# EAGLE design Main (EAGLE 7.7.0)
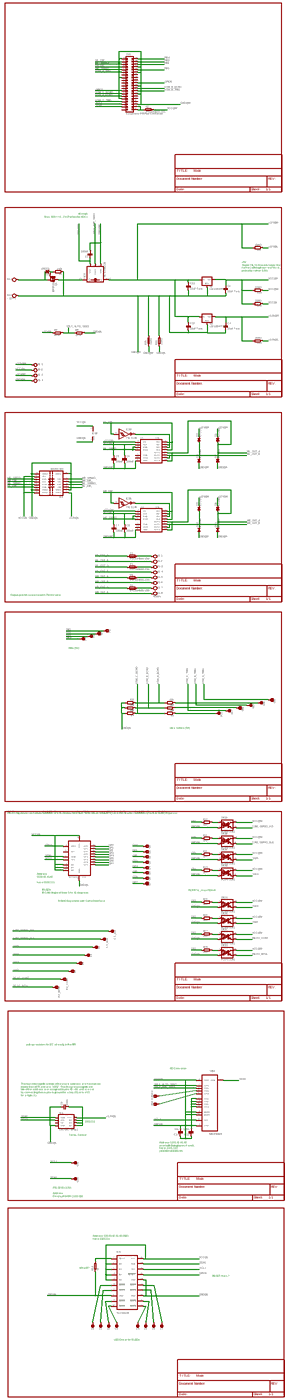
[diagram p0: schematic, sheet 1, overview]
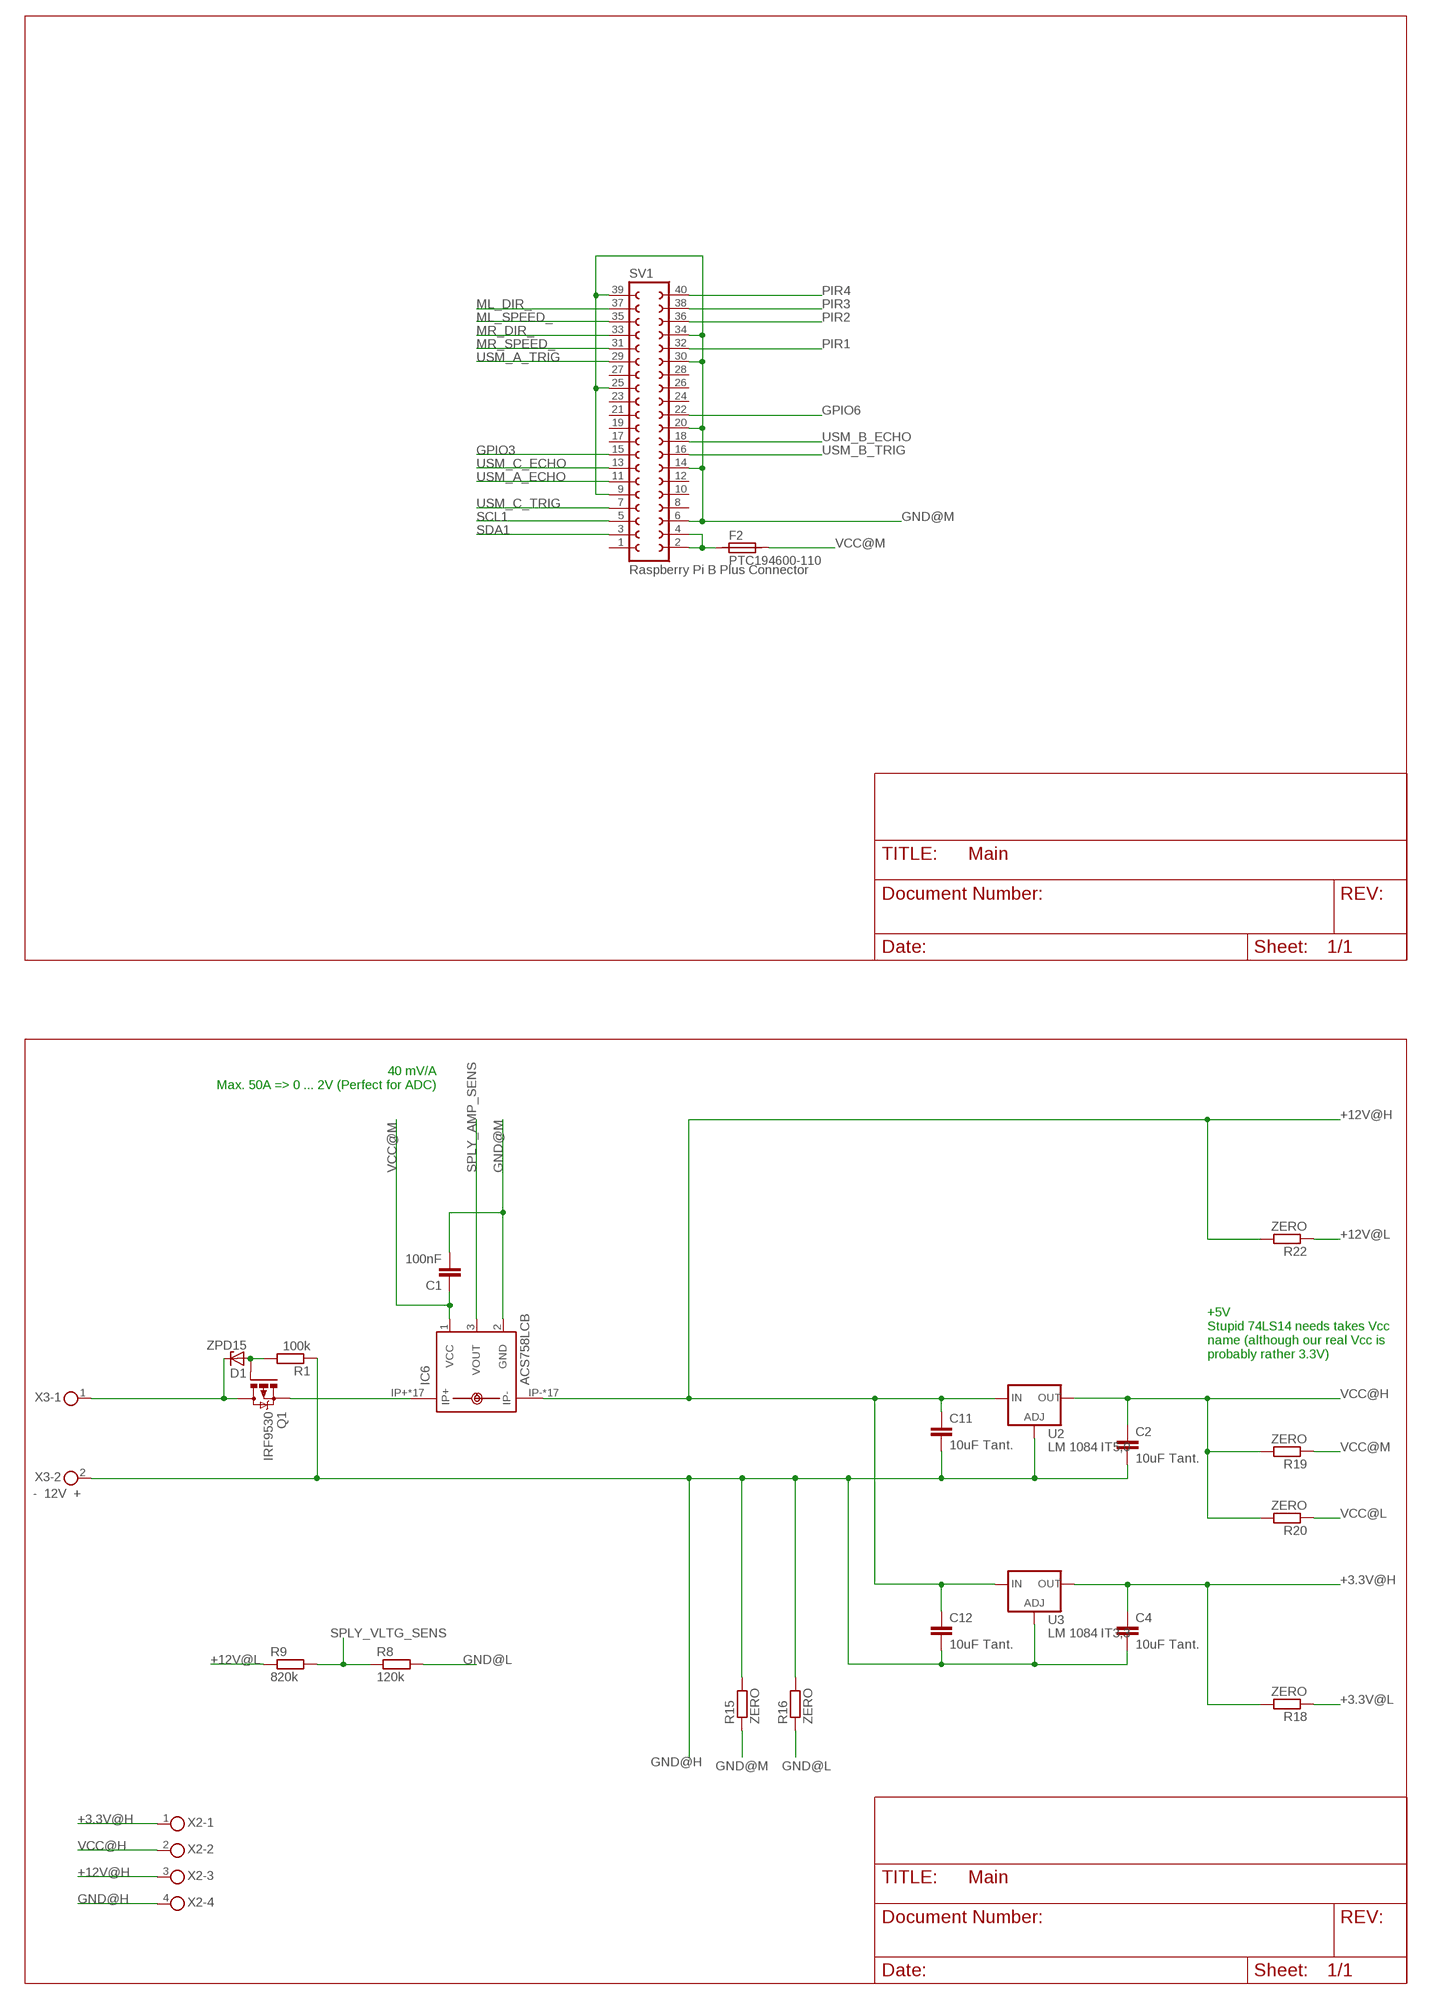
[diagram p1: schematic, sheet 1, part 1 of 4]
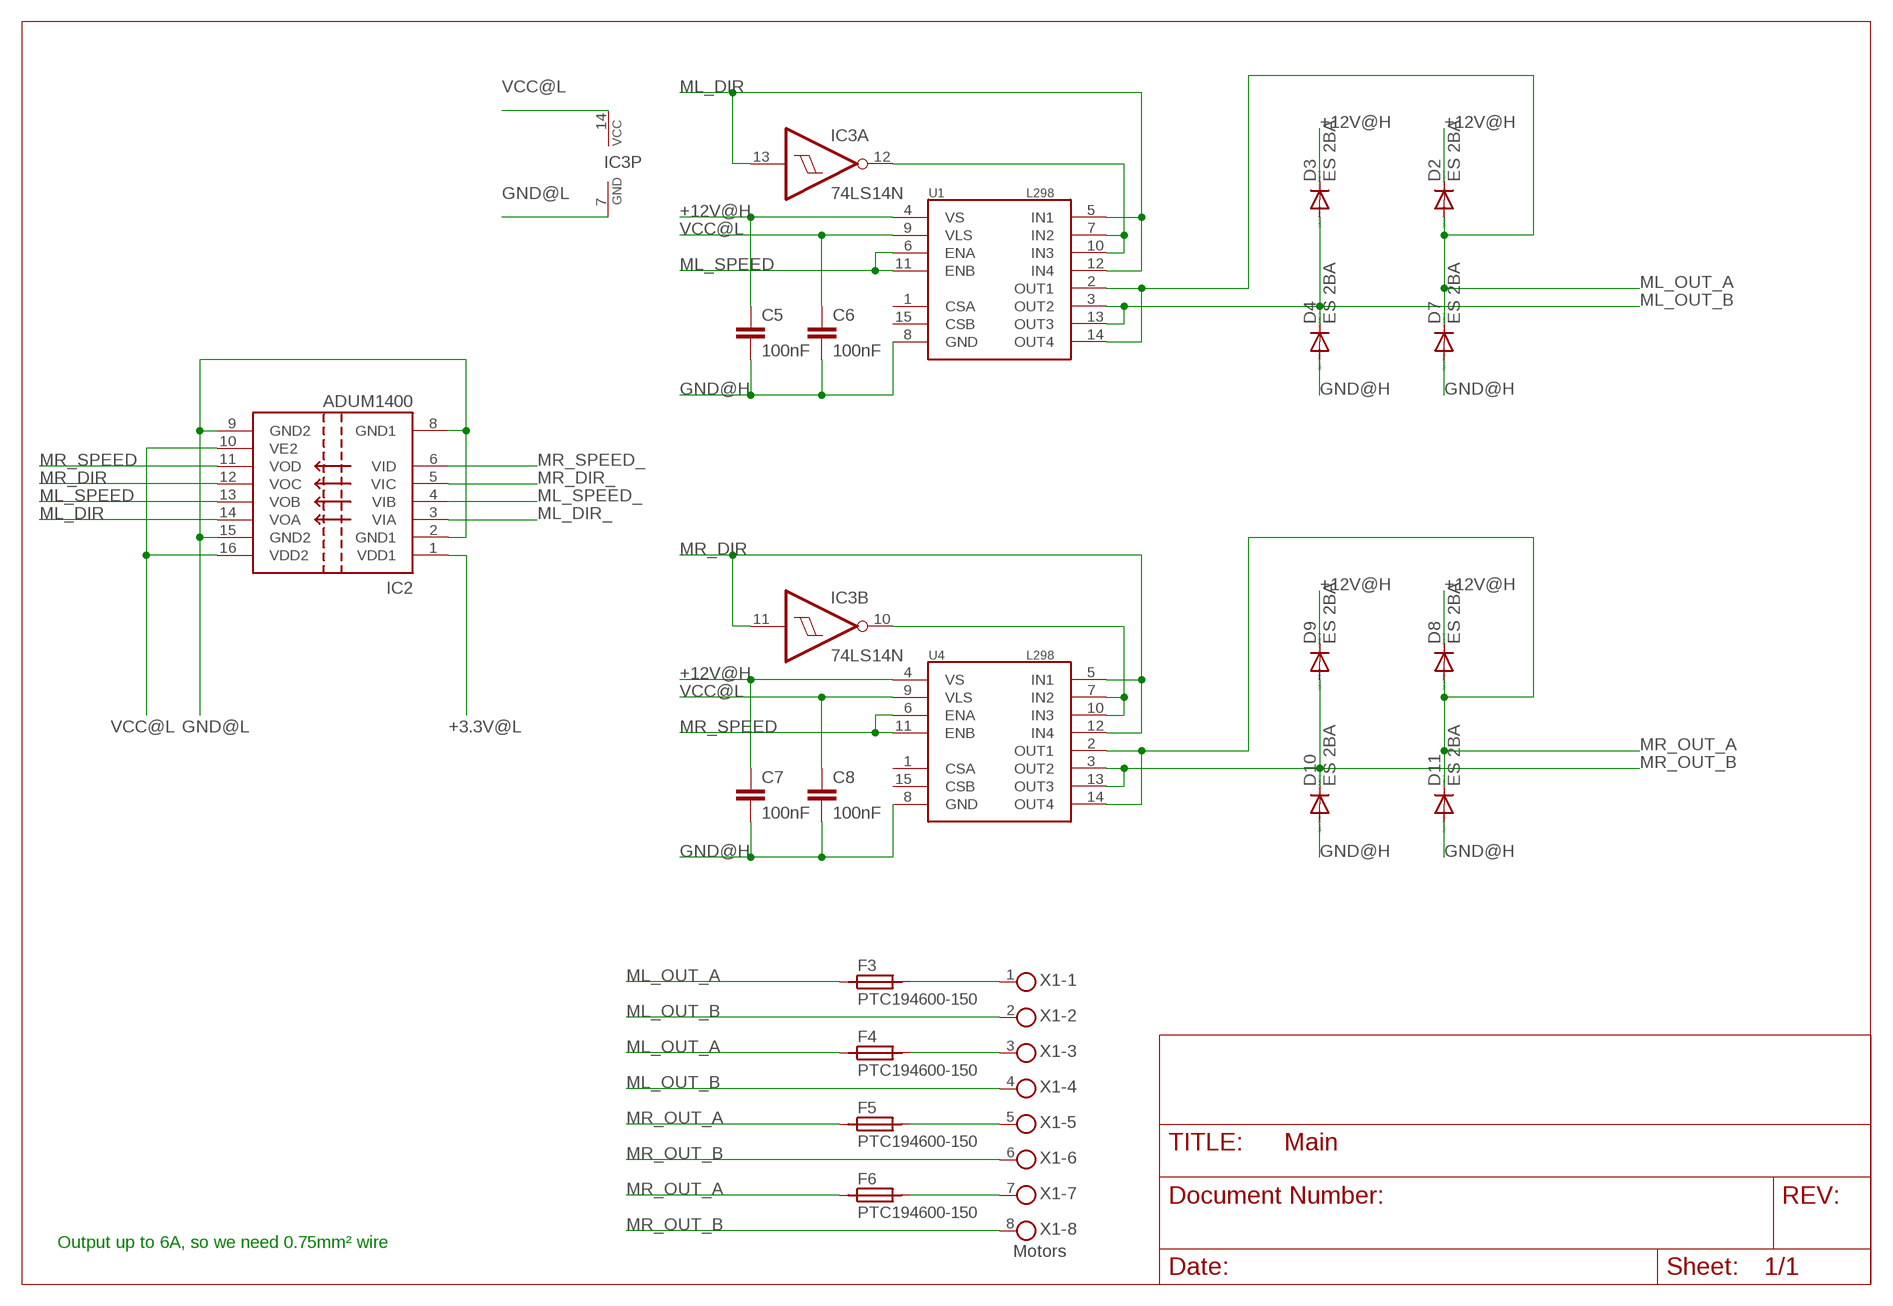
[diagram p2: schematic, sheet 1, part 2 of 4]
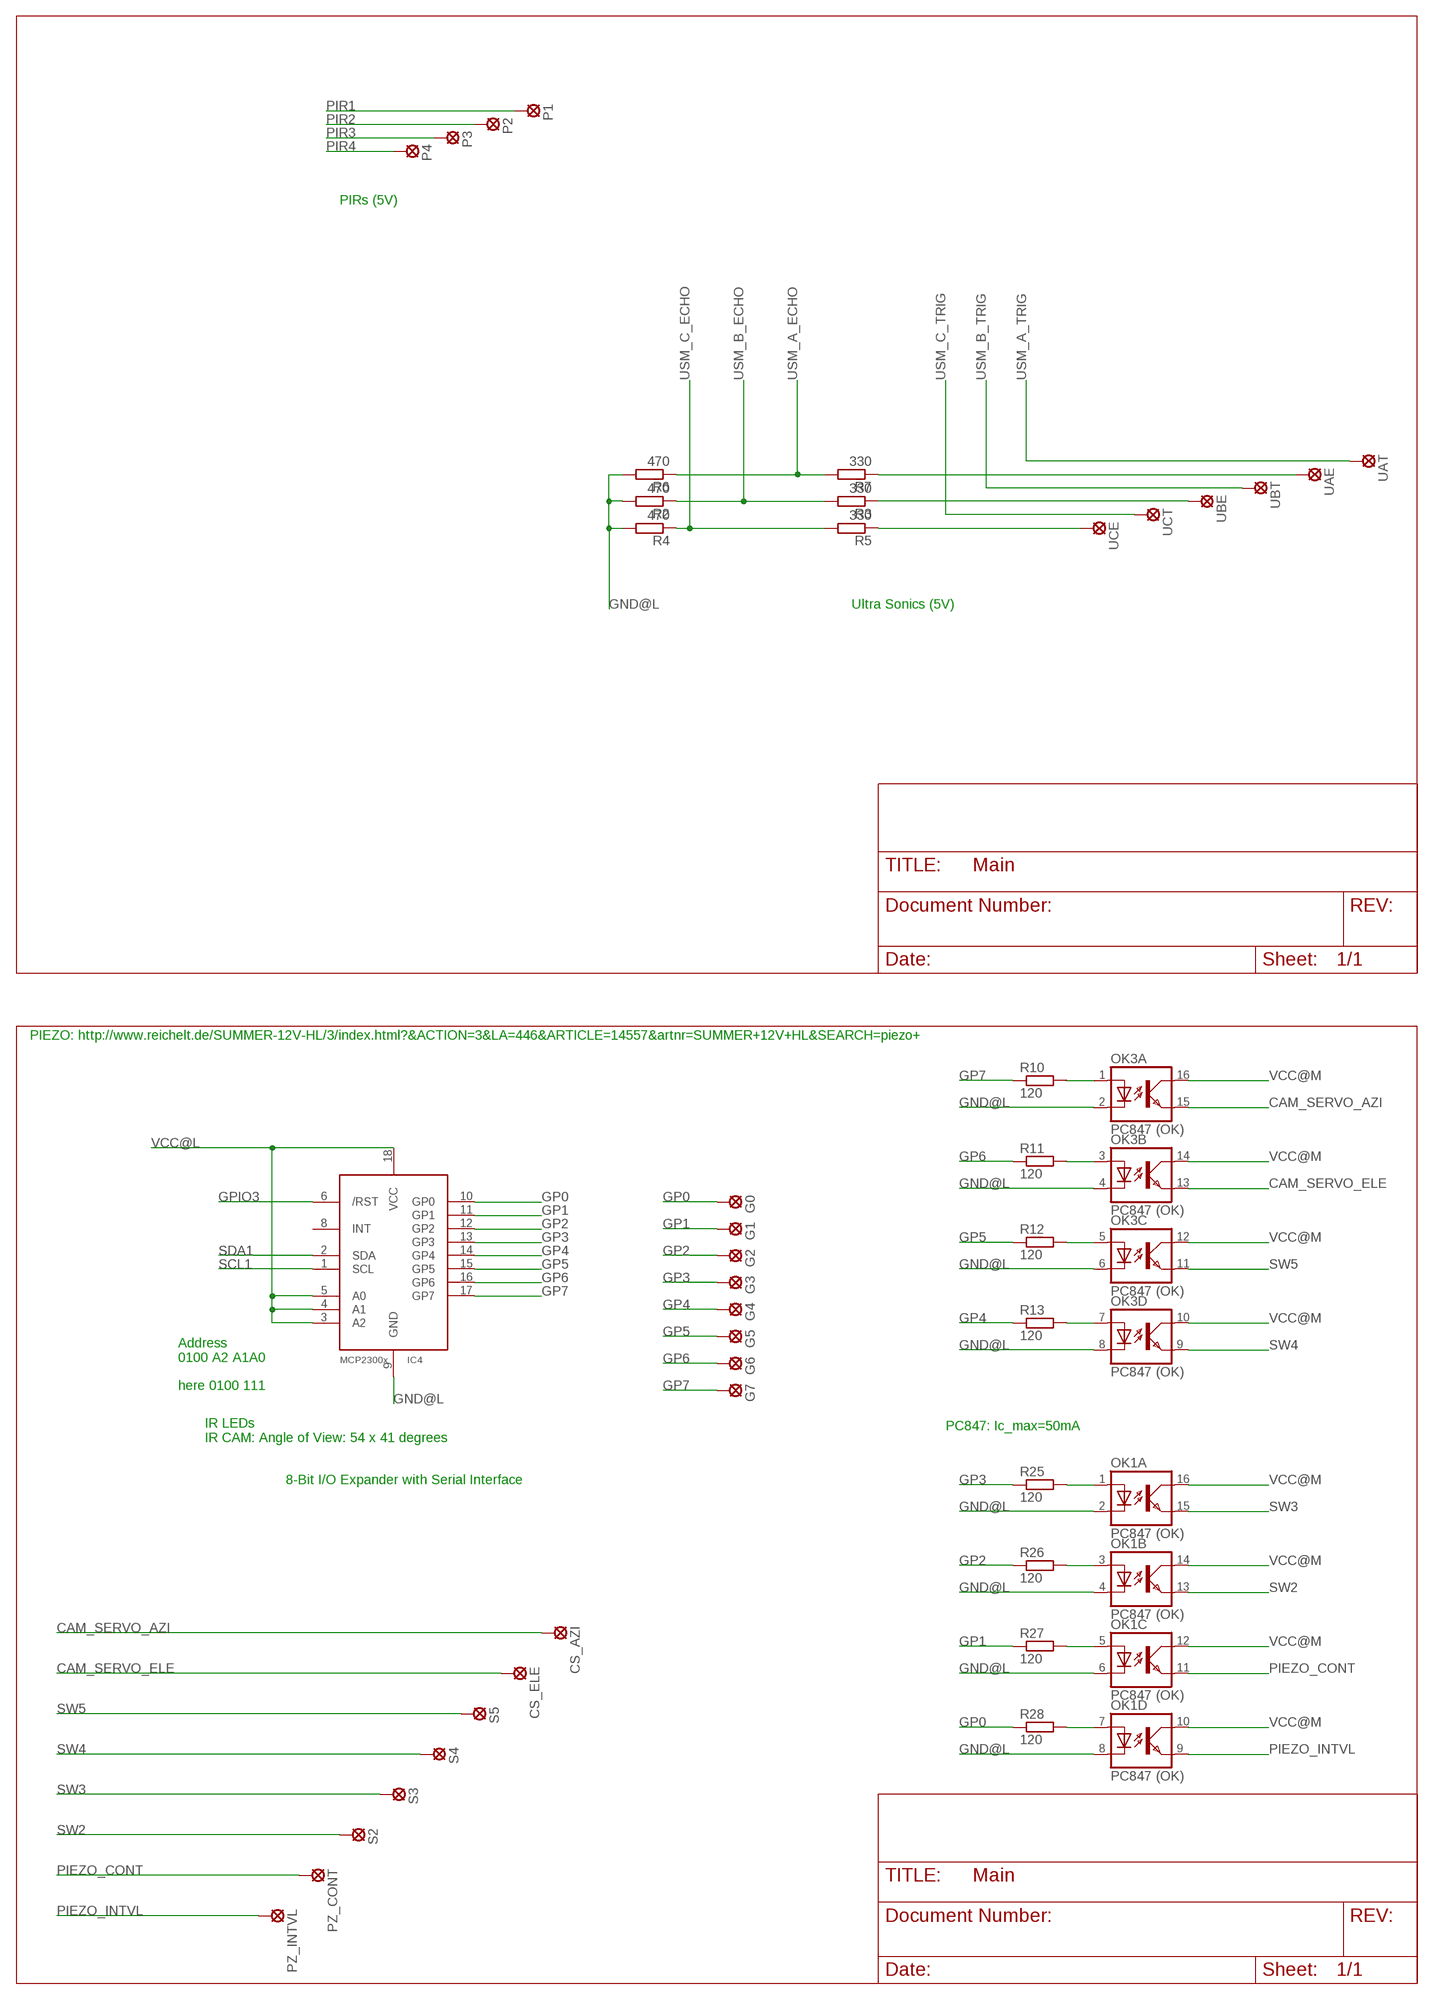
[diagram p3: schematic, sheet 1, part 3 of 4]
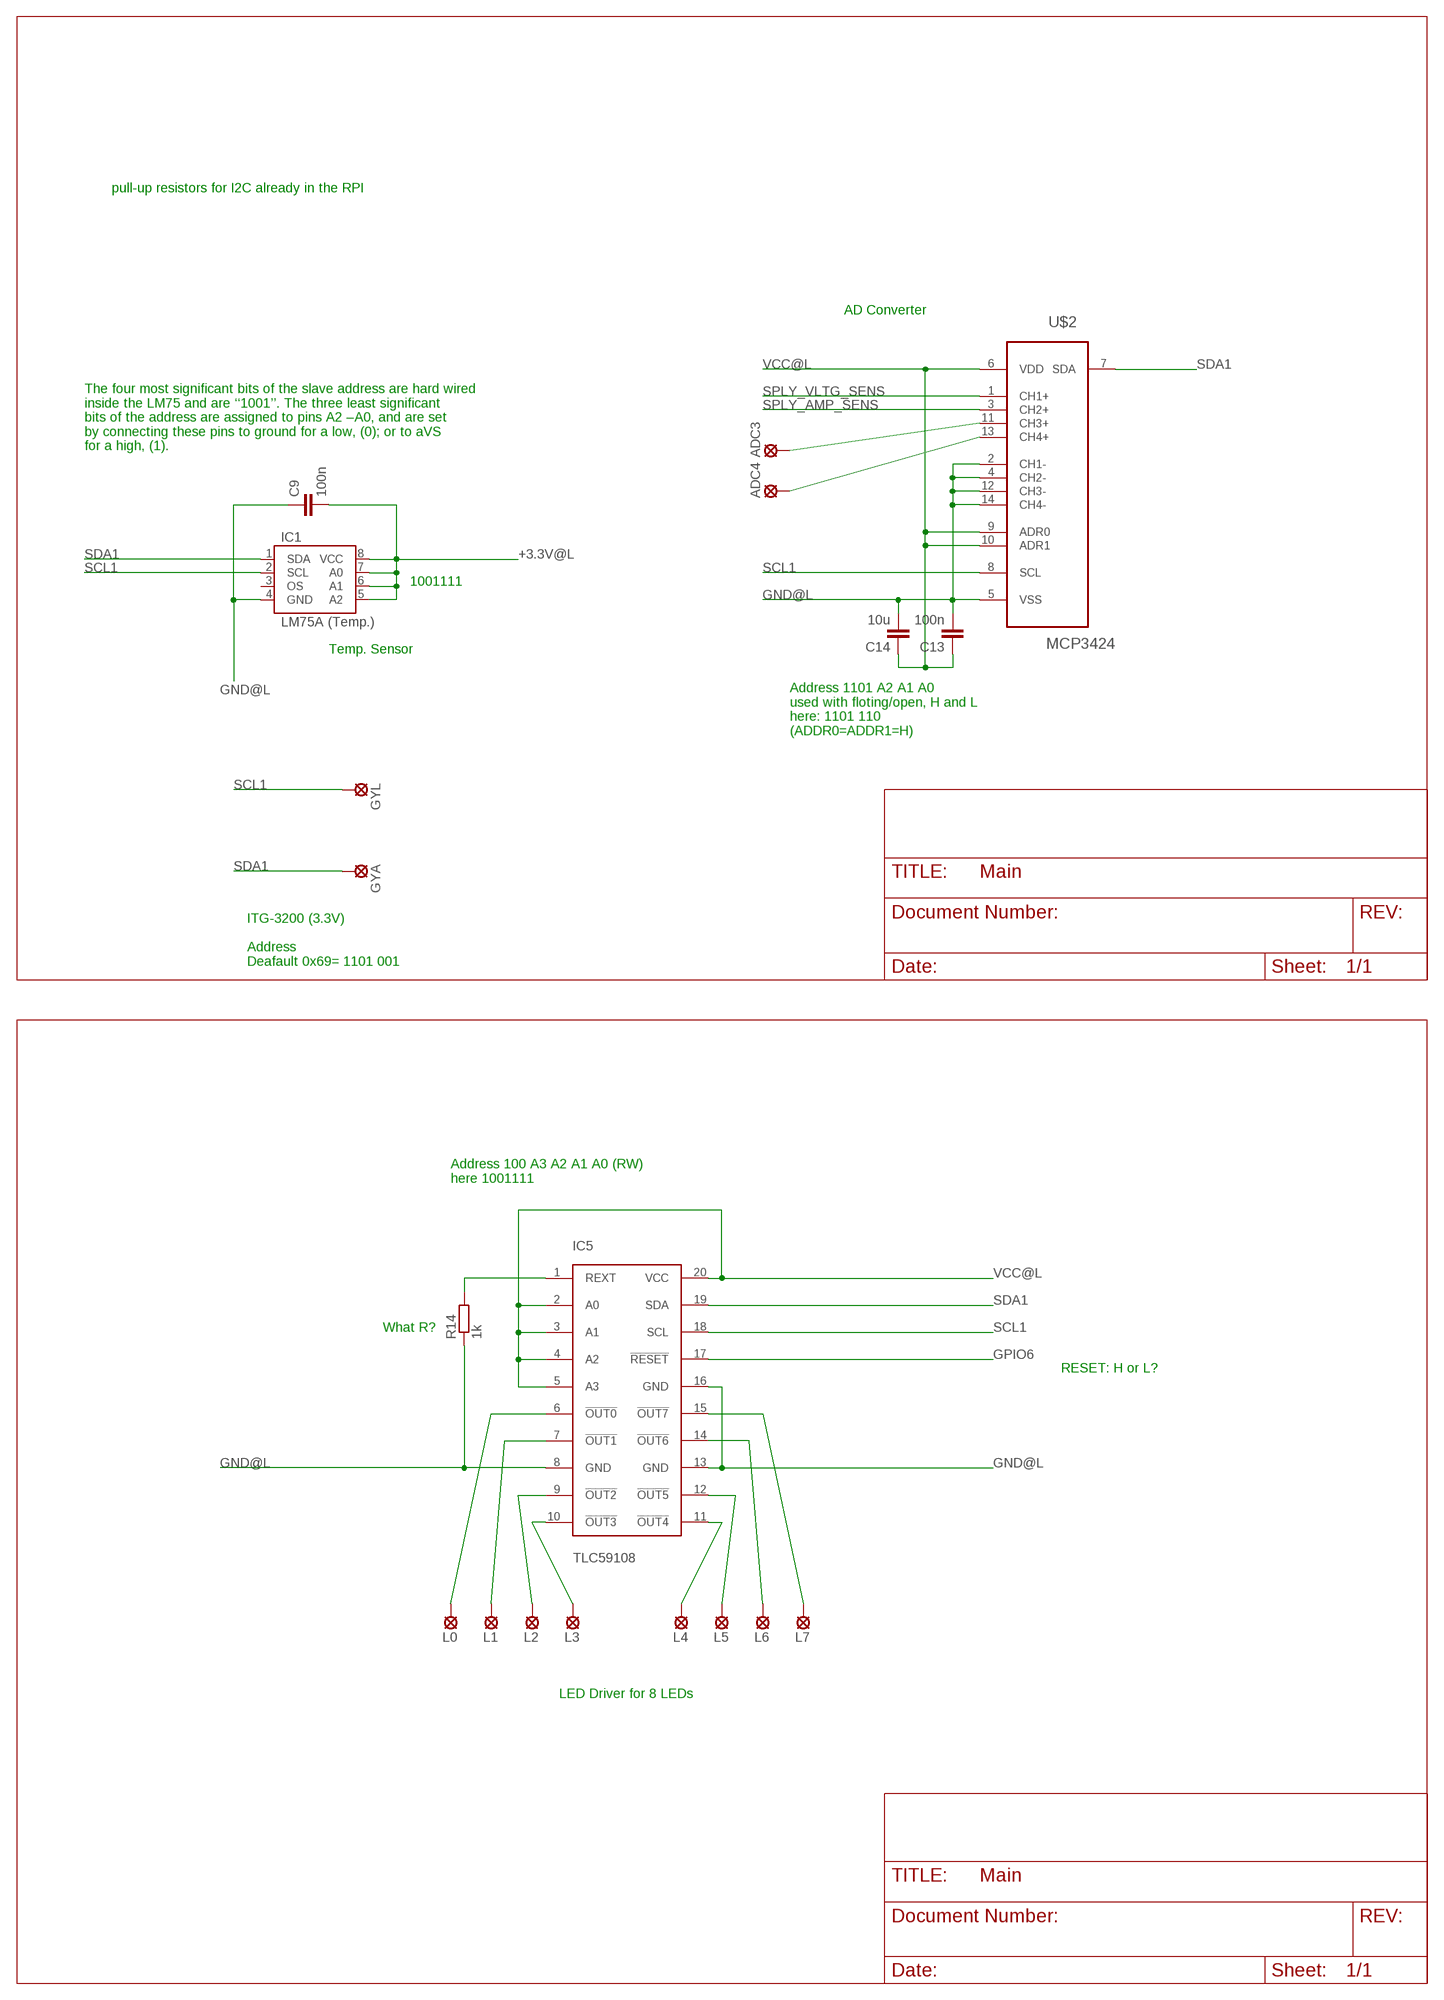
[diagram p4: schematic, sheet 1, part 4 of 4]

## Parts
ADC3  LSP10  [LSP10]
ADC4  LSP10  [LSP10]
C1  100nF  C-EUC0805  [C0805]
C2  10uF Tant.  C-EU025-040X050  [C025-040X050]
C4  10uF Tant.  C-EU025-040X050  [C025-040X050]
C5  100nF  C-EUC0805  [C0805]
C6  100nF  C-EUC0805  [C0805]
C7  100nF  C-EUC0805  [C0805]
C8  100nF  C-EUC0805  [C0805]
C9  100n  C-EUC0805  [C0805]
C11  10uF Tant.  C-EU025-040X050  [C025-040X050]
C12  10uF Tant.  C-EU025-040X050  [C025-040X050]
C13  100n  C-EUC0805  [C0805]
C14  10u  C-EUC0805  [C0805]
CS_AZI  LSP10  [LSP10]
CS_ELE  LSP10  [LSP10]
D1  ZPD15  ZENER-DIODEDO35Z10  [DO35Z10]
D2  ES 2BA  ES2D  [SMB]
D3  ES 2BA  ES2D  [SMB]
D4  ES 2BA  ES2D  [SMB]
D7  ES 2BA  ES2D  [SMB]
D8  ES 2BA  ES2D  [SMB]
D9  ES 2BA  ES2D  [SMB]
D10  ES 2BA  ES2D  [SMB]
D11  ES 2BA  ES2D  [SMB]
F2  PTC194600-110  SIBA194600  [1820]
F3  PTC194600-150  SIBA194600  [1820]
F4  PTC194600-150  SIBA194600  [1820]
F5  PTC194600-150  SIBA194600  [1820]
F6  PTC194600-150  SIBA194600  [1820]
G0  LSP10  [LSP10]
G1  LSP10  [LSP10]
G2  LSP10  [LSP10]
G3  LSP10  [LSP10]
G4  LSP10  [LSP10]
G5  LSP10  [LSP10]
G6  LSP10  [LSP10]
G7  LSP10  [LSP10]
GYA  LSP10  [LSP10]
GYL  GYRO_SCL  LSP10  [LSP10]
IC1  LM75A (Temp.)  LM75A  [SO8]
IC2  ADUM1400  [SO16W]
IC3  74LS14N  [DIL14]
IC4  MCP2300X/P  [DIL18]
IC5  TLC59108  [TSSOP20]
IC6  ACS758LCB  ACS758LCB-050B-PFF-T  [CB-PFF]
L0  LSP10  [LSP10]
L1  LSP10  [LSP10]
L2  LSP10  [LSP10]
L3  LSP10  [LSP10]
L4  LSP10  [LSP10]
L5  LSP10  [LSP10]
L6  LSP10  [LSP10]
L7  LSP10  [LSP10]
OK1  PC847 (OK)  PC847  [DIL16]
OK3  PC847 (OK)  PC847  [DIL16]
P1  LSP10  [LSP10]
P2  LSP10  [LSP10]
P3  LSP10  [LSP10]
P4  LSP10  [LSP10]
PZ_CONT  LSP10  [LSP10]
PZ_INTVL  LSP10  [LSP10]
Q1  IRF9530  [TO220BV]
R1  100k  R-EU_R0805  [R0805]
R2  470  R-EU_R0603  [R0603]
R3  330  R-EU_R0603  [R0603]
R4  470  R-EU_R0603  [R0603]
R5  330  R-EU_R0603  [R0603]
R6  470  R-EU_R0603  [R0603]
R7  330  R-EU_R0603  [R0603]
R8  120k  R-EU_R0603  [R0603]
R9  820k  R-EU_R0603  [R0603]
R10  120  R-EU_R0603  [R0603]
R11  120  R-EU_R0603  [R0603]
R12  120  R-EU_R0603  [R0603]
R13  120  R-EU_R0603  [R0603]
R14  1k  R-EU_R0603  [R0603]
R15  ZERO  R-EU_0204/2V  [0204V]
R16  ZERO  R-EU_0204/2V  [0204V]
R18  ZERO  R-EU_0204/2V  [0204V]
R19  ZERO  R-EU_0204/2V  [0204V]
R20  ZERO  R-EU_0204/2V  [0204V]
R22  ZERO  R-EU_0204/2V  [0204V]
R25  120  R-EU_R0603  [R0603]
R26  120  R-EU_R0603  [R0603]
R27  120  R-EU_R0603  [R0603]
R28  120  R-EU_R0603  [R0603]
S2  LSP10  [LSP10]
S3  LSP10  [LSP10]
S4  LSP10  [LSP10]
S5  LSP10  [LSP10]
SV1  Raspberry Pi B Plus Connector  FE20-2  [FE20-2]
U1  L298  [MULTIWATT15]
U2  LM 1084 IT5,0  LM1084-V  [317TS]
U3  LM 1084 IT3,3  LM1084-V  [317TS]
U4  L298  [MULTIWATT15]
U$2  MCP3424  MCP3424-E/ST  [SOP65P640X120-14N]
UAE  LSP10  [LSP10]
UAT  LSP10  [LSP10]
UBE  LSP10  [LSP10]
UBT  LSP10  [LSP10]
UCE  LSP10  [LSP10]
UCT  LSP10  [LSP10]
X1  Motors  AKL59-08  [8POL35]
X2  AKL59-04  [4POL35]
X3  - 12V +  AKL59-02  [2POL35]

## Nets
+3.3V@H [H]: C4.1 R18.2 U3.2(OUT) X2.1
+3.3V@L [L]: C9.2 IC1.5(A2) IC1.6(A1) IC1.7(A0) IC1.8(VCC) IC2.1(VDD1) R18.1
+12V@H [H]: C5.1 C7.1 C11.1 C12.1 D2.C D3.C D8.C D9.C IC6.IP- IC6.IP-@2(IP-) IC6.IP-@3(IP-) IC6.IP-@4(IP-) IC6.IP-@5(IP-) IC6.IP-@6(IP-) IC6.IP-@7(IP-) IC6.IP-@8(IP-) IC6.IP-@9(IP-) IC6.IP-@10(IP-) IC6.IP-@11(IP-) IC6.IP-@12(IP-) IC6.IP-@13(IP-) IC6.IP-@14(IP-) IC6.IP-@15(IP-) IC6.IP-@16(IP-) IC6.IP-@17(IP-) R22.2 U1.4(VS) U2.3(IN) U3.3(IN) U4.4(VS) X2.3
+12V@L [L]: R9.1 R22.1
CAM_SERVO_AZI: CS_AZI.MP OK3.15(A:EMIT)
CAM_SERVO_ELE: CS_ELE.MP OK3.13(B:EMIT)
GND@H [H]: C2.2 C4.2 C5.2 C6.2 C7.2 C8.2 C11.2 C12.2 D4.A D7.A D10.A D11.A R1.1 R15.2 R16.2 U1.8(GND) U2.1(ADJ) U3.1(ADJ) U4.8(GND) X2.4 X3.2
GND@L [L]: C9.1 C13.2 C14.2 IC1.4(GND) IC2.2(GND1) IC2.8(GND1) IC2.9(GND2) IC2.15(GND2) IC3.7(P:GND) IC4.9(GND) IC5.8(GND) IC5.13(GND) IC5.16(GND) OK1.2(A:C) OK1.4(B:C) OK1.6(C:C) OK1.8(D:C) OK3.2(A:C) OK3.4(B:C) OK3.6(C:C) OK3.8(D:C) R2.2 R4.2 R6.2 R8.2 R14.1 R16.1 U$2.2(CH1-) U$2.4(CH2-) U$2.5(VSS) U$2.12(CH3-) U$2.14(CH4-)
GND@M [L]: C1.2 IC6.2(GND) R15.1 SV1.6 SV1.9 SV1.14 SV1.20 SV1.25 SV1.30 SV1.34 SV1.39
GP0: G0.MP IC4.10(GP0) R28.1
GP1: G1.MP IC4.11(GP1) R27.1
GP2: G2.MP IC4.12(GP2) R26.1
GP3: G3.MP IC4.13(GP3) R25.1
GP4: G4.MP IC4.14(GP4) R13.1
GP5: G5.MP IC4.15(GP5) R12.1
GP6: G6.MP IC4.16(GP6) R11.1
GP7: G7.MP IC4.17(GP7) R10.1
GPIO3: IC4.6(/RST) SV1.15
GPIO6 [L]: IC5.17(!RESET) SV1.22
ML_B: IC3.12(A:O) U1.7(IN2) U1.10(IN3)
ML_DIR [L]: IC2.14(VOA) IC3.13(A:I) U1.5(IN1) U1.12(IN4)
ML_DIR_: IC2.3(VIA) SV1.37
ML_OUT_A [H]: D2.A D7.C F3.1 F4.1 U1.2(OUT1) U1.14(OUT4)
ML_OUT_B [H]: D3.A D4.C U1.3(OUT2) U1.13(OUT3) X1.2 X1.4
ML_SPEED [L]: IC2.13(VOB) U1.6(ENA) U1.11(ENB)
ML_SPEED_: IC2.4(VIB) SV1.35
MR_B: IC3.10(B:O) U4.7(IN2) U4.10(IN3)
MR_DIR [L]: IC2.12(VOC) IC3.11(B:I) U4.5(IN1) U4.12(IN4)
MR_DIR_: IC2.5(VIC) SV1.33
MR_OUT_A [H]: D8.A D11.C F5.1 F6.1 U4.2(OUT1) U4.14(OUT4)
MR_OUT_B [H]: D9.A D10.C U4.3(OUT2) U4.13(OUT3) X1.6 X1.8
MR_SPEED [L]: IC2.11(VOD) U4.6(ENA) U4.11(ENB)
MR_SPEED_: IC2.6(VID) SV1.31
N$1 [L]: IC5.1(REXT) R14.2
N$2: D1.A Q1.G R1.2
N$4 [H]: D1.C Q1.D X3.1
N$5 [M]: F2.1 SV1.2 SV1.4
N$6 [L]: IC5.11(!OUT4) L4.MP
N$7 [H]: F3.2 X1.1
N$8 [L]: IC5.10(!OUT3) L3.MP
N$12 [L]: IC5.9(!OUT2) L2.MP
N$13: OK3.1(A:A) R10.2
N$20 [L]: ADC3.MP U$2.11(CH3+)
N$21: OK3.3(B:A) R11.2
N$22: R7.1 UAE.MP
N$23: OK3.5(C:A) R12.2
N$24: R3.1 UBE.MP
N$25: OK3.7(D:A) R13.2
N$26 [H]: F4.2 X1.3
N$27 [L]: IC5.7(!OUT1) L1.MP
N$28 [L]: IC5.6(!OUT0) L0.MP
N$29 [L]: IC5.15(!OUT7) L7.MP
N$31 [L]: IC5.14(!OUT6) L6.MP
N$33: R5.1 UCE.MP
N$34 [H]: F5.2 X1.5
N$36 [H]: F6.2 X1.7
N$43 [L]: IC5.12(!OUT5) L5.MP
N$44: OK1.1(A:A) R25.2
N$45: OK1.3(B:A) R26.2
N$46: OK1.5(C:A) R27.2
N$47: OK1.7(D:A) R28.2
N$48 [H]: IC6.IP+ IC6.IP+@2(IP+) IC6.IP+@3(IP+) IC6.IP+@4(IP+) IC6.IP+@5(IP+) IC6.IP+@6(IP+) IC6.IP+@7(IP+) IC6.IP+@8(IP+) IC6.IP+@9(IP+) IC6.IP+@10(IP+) IC6.IP+@11(IP+) IC6.IP+@12(IP+) IC6.IP+@13(IP+) IC6.IP+@14(IP+) IC6.IP+@15(IP+) IC6.IP+@16(IP+) IC6.IP+@17(IP+) Q1.S
N$49 [L]: ADC4.MP U$2.13(CH4+)
PIEZO_CONT: OK1.11(C:EMIT) PZ_CONT.MP
PIEZO_INTVL: OK1.9(D:EMIT) PZ_INTVL.MP
PIR1: P1.MP SV1.32
PIR2: P2.MP SV1.36
PIR3: P3.MP SV1.38
PIR4: P4.MP SV1.40
SCL1 [L]: GYL.MP IC1.2(SCL) IC4.1(SCL) IC5.18(SCL) SV1.5 U$2.8(SCL)
SDA1 [L]: GYA.MP IC1.1(SDA) IC4.2(SDA) IC5.19(SDA) SV1.3 U$2.7(SDA)
SPLY_AMP_SENS [L]: IC6.3(VOUT) U$2.3(CH2+)
SPLY_VLTG_SENS [L]: R8.1 R9.2 U$2.1(CH1+)
SW2: OK1.13(B:EMIT) S2.MP
SW3: OK1.15(A:EMIT) S3.MP
SW4 [L]: OK3.9(D:EMIT) S4.MP
SW5: OK3.11(C:EMIT) S5.MP
USM_A_ECHO: R6.1 R7.2 SV1.11
USM_A_TRIG: SV1.29 UAT.MP
USM_B_ECHO: R2.1 R3.2 SV1.18
USM_B_TRIG: SV1.16 UBT.MP
USM_C_ECHO: R4.1 R5.2 SV1.13
USM_C_TRIG: SV1.7 UCT.MP
VCC@H [H]: C2.1 R19.2 R20.2 U2.2(OUT) X2.2
VCC@L [L]: C6.1 C8.1 C13.1 C14.1 IC2.10(VE2) IC2.16(VDD2) IC3.14(P:VCC) IC4.3(A2) IC4.4(A1) IC4.5(A0) IC4.18(VCC) IC5.2(A0) IC5.3(A1) IC5.4(A2) IC5.5(A3) IC5.20(VCC) R20.1 U1.9(VLS) U4.9(VLS) U$2.6(VDD) U$2.9(ADR0) U$2.10(ADR1)
VCC@M [M]: C1.1 F2.2 IC6.1(VCC) OK1.10(D:COL) OK1.12(C:COL) OK1.14(B:COL) OK1.16(A:COL) OK3.10(D:COL) OK3.12(C:COL) OK3.14(B:COL) OK3.16(A:COL) R19.1
Unconnected: IC1.3(OS) IC3.1(D:I) IC3.2(D:O) IC3.3(E:I) IC3.4(E:O) IC3.5(F:I) IC3.6(F:O) IC3.8(C:O) IC3.9(C:I) IC4.8(INT) SV1.1 SV1.8 SV1.10 SV1.12 SV1.17 SV1.19 SV1.21 SV1.23 SV1.24 SV1.26 SV1.27 SV1.28 U1.1(CSA) U1.15(CSB) U4.1(CSA) U4.15(CSB)

## Notes on the sheet
- 40 mV/A
  Max. 50A => 0 ... 2V (Perfect for ADC)
- +5V
  Stupid 74LS14 needs takes Vcc 
  name (although our real Vcc is 
  probably rather 3.3V)
- Output up to 6A, so we need 0.75mm² wire
- PIRs (5V)
- Ultra Sonics (5V)
- PIEZO: http://www.reichelt.de/SUMMER-12V-HL/3/index.html?&ACTION=3&LA=446&ARTICLE=14557&artnr=SUMMER+12V+HL&SEARCH=piezo+
- Address
  0100 A2 A1A0
  
  here 0100 111
- PC847: Ic_max=50mA
- IR LEDs
  IR CAM: Angle of View: 54 x 41 degrees
- 8-Bit I/O Expander with Serial Interface
- pull-up resistors for I2C already in the RPI
- AD Converter
- The four most significant bits of the slave address are hard wired
  inside the LM75 and are ‘‘1001’’. The three least significant
  bits of the address are assigned to pins A2 –A0, and are set
  by connecting these pins to ground for a low, (0); or to aVS
  for a high, (1).
- 1001111
- Temp. Sensor
- Address 1101 A2 A1 A0
  used with floting/open, H and L
  here: 1101 110
  (ADDR0=ADDR1=H)
- ITG-3200 (3.3V)
  
  Address 
  Deafault 0x69= 1101 001
- Address 100 A3 A2 A1 A0 (RW)
  here 1001111
- What R?
- RESET: H or L?
- LED Driver for 8 LEDs

## Library data of the parts
ADC3 ADC4 CS_AZI CS_ELE G0 G1-G7 GYA GYL L0 L1-L7 P1-P4 PZ_CONT PZ_INTVL S2-S5 UAE UAT UBE UBT UCE UCT = solpad:LSP10: SOLDER PAD drill 1.0 mm, distributor Buerklin, 12H555
C1 C2 C4-C9 C11-C14 = rcl:C-EU: CAPACITOR, European symbol
D1 = diode:ZENER-DIODE: Z-Diode
D2-D4 D7-D11 = diode:ES2D: DIODE super fast rectifier, 2 A
F2-F6 = _hhn_PtcFuses_Siba_r500:SIBA194600*: SIBA PTC-Fuses, Series 194600, 1812 (4.5 3.2)mm Source: www.siba.de/ Package: SMD 1812 (4.5 x 3.2)mm Technologies: SIBA194600Axxx xxx: Trip-Current * 10 mA Author: Dipl.-Ing. FH Rainer Bayer
IC1 = philips-3:LM75A
IC2 = adum140x:ADUM1400
IC3 = 74xx-eu:74*14: Hex schmitt trigger INVERTER
IC4 = adafruit:MCP2300X: MCP23008 Inexpensive i2c i/o expander - 8 general purpose i/o pins with optional pullups
IC5 = TLC59108:TLC59108: 8-Bit Fast Mode Plus (FM+) I2C Bus Constant-Current LED Sink Driver
IC6 = allegro:ACS758*: Thermally Enhanced, Fully Integrated, Hall Effect-Based Linear Current Sensor with 100 micro Ohm Current Conductor display layer 49 Reference in BRD and place VIAs on circles Source: http://www.allegromicro.com/en/Products/Part_Numbers/0758/0758.pdf; MPN: ACS758LCB-050B-PFF-T; OC_FARNELL: 1718997; OC_NEWARK: 04R7131
OK1 OK3 = optocoupler:PC847: SHARP OPTO COUPLER; OC_FARNELL: 9707735; OC_NEWARK: unknown
Q1 = transistor-power:IRF9530: P-CHANNEL HEXFET POWER-MOS-FET Source: http://www.irf.com/product-info/datasheets/data/irf9530.pdf
R1-R7 R10-R13 R15 R16 R18-R20 R22 R25-R28 = resistor:R-EU_: RESISTOR, European symbol
R8 R9 = rcl-2:R-EU_: RESISTOR, European symbol
R14 = rcl:R-EU_: RESISTOR, European symbol
SV1 = con-lsta:FE20-2: FEMALE HEADER; OC_FARNELL: unknown; OC_NEWARK: unknown
U1 U4 = SparkFun-PowerIC:L298: L298 Dual Full Bridge Driver
U2 U3 = v-reg-2:LM1084: VOLTAGE REGULATOR
U$2 = eagleParts:MCP3424-E/ST: Analog-to-Digital Converter; MPN: MCP3424-E/ST; OC_FARNELL: 1630423; OC_NEWARK: 54M4872; PACKAGE: SOP-14; SUPPLIER: Microchip
X1 = con-ria-59:AKL59-08: RIA Anschlussklemme Typ 59, Raster 3,5 mm, Polzahl 8
X2 = con-ria-59:AKL59-04: RIA Anschlussklemme Typ 59, Raster 3,5 mm, Polzahl 4
X3 = con-ria-59:AKL59-02: RIA Anschlussklemme Typ 59, Raster 3,5 mm, Polzahl 2

## Net classes
0 default: width 0.508 mm
1 H: width 1.651 mm
2 M: width 1.016 mm
3 L: width 0.254 mm

## Board
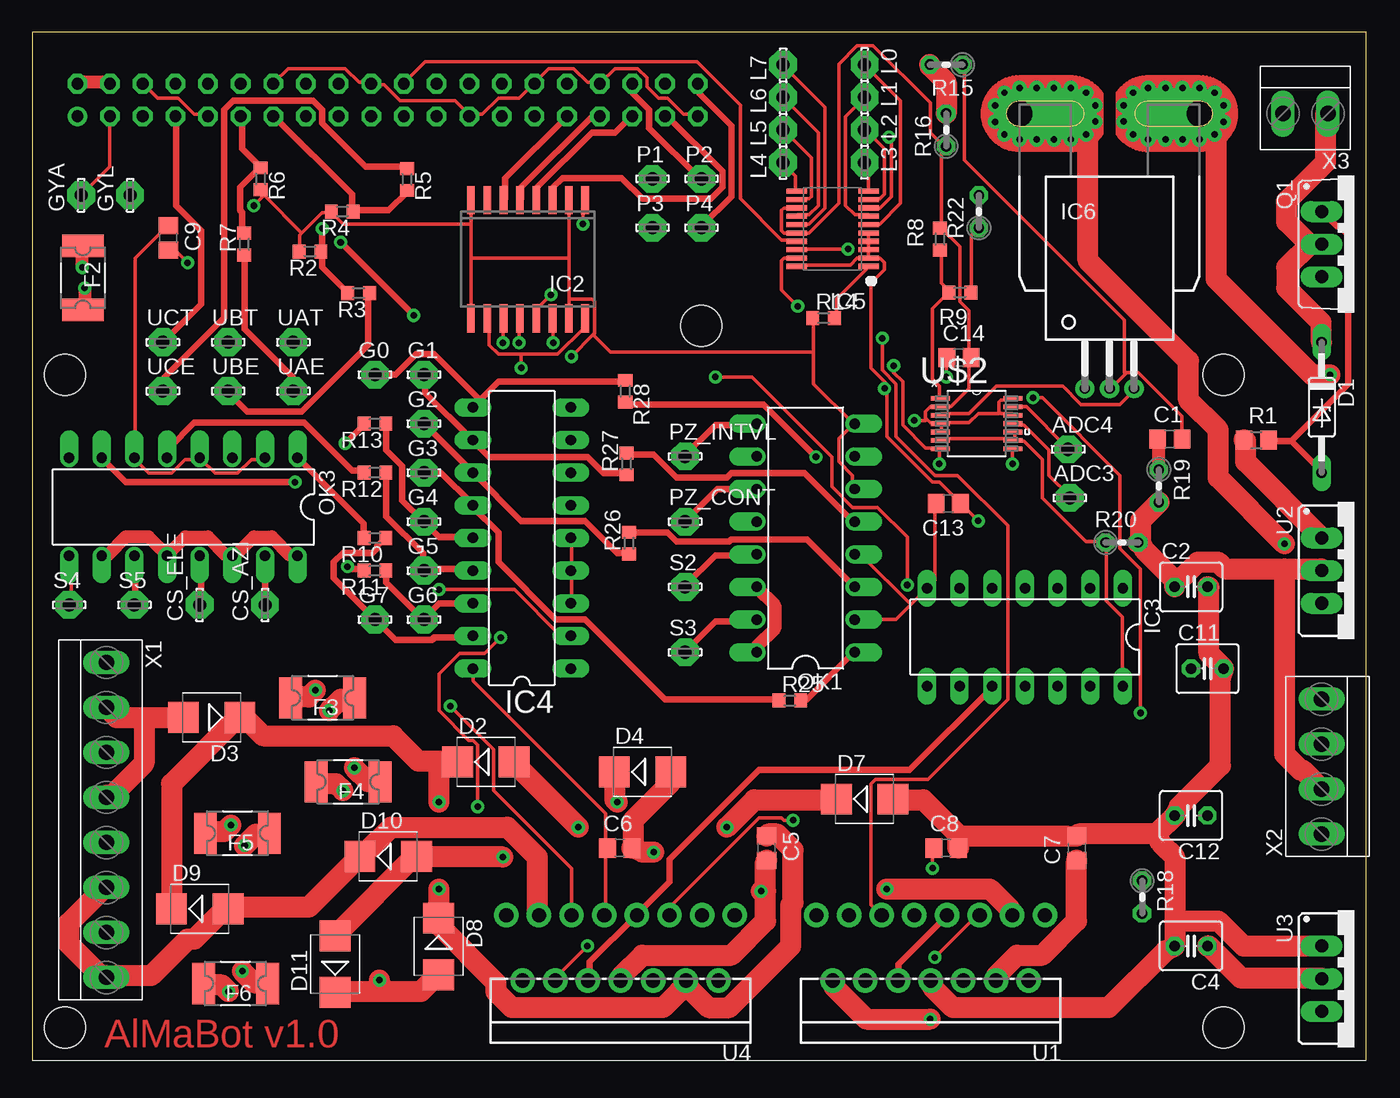
[diagram p5: board, top side]
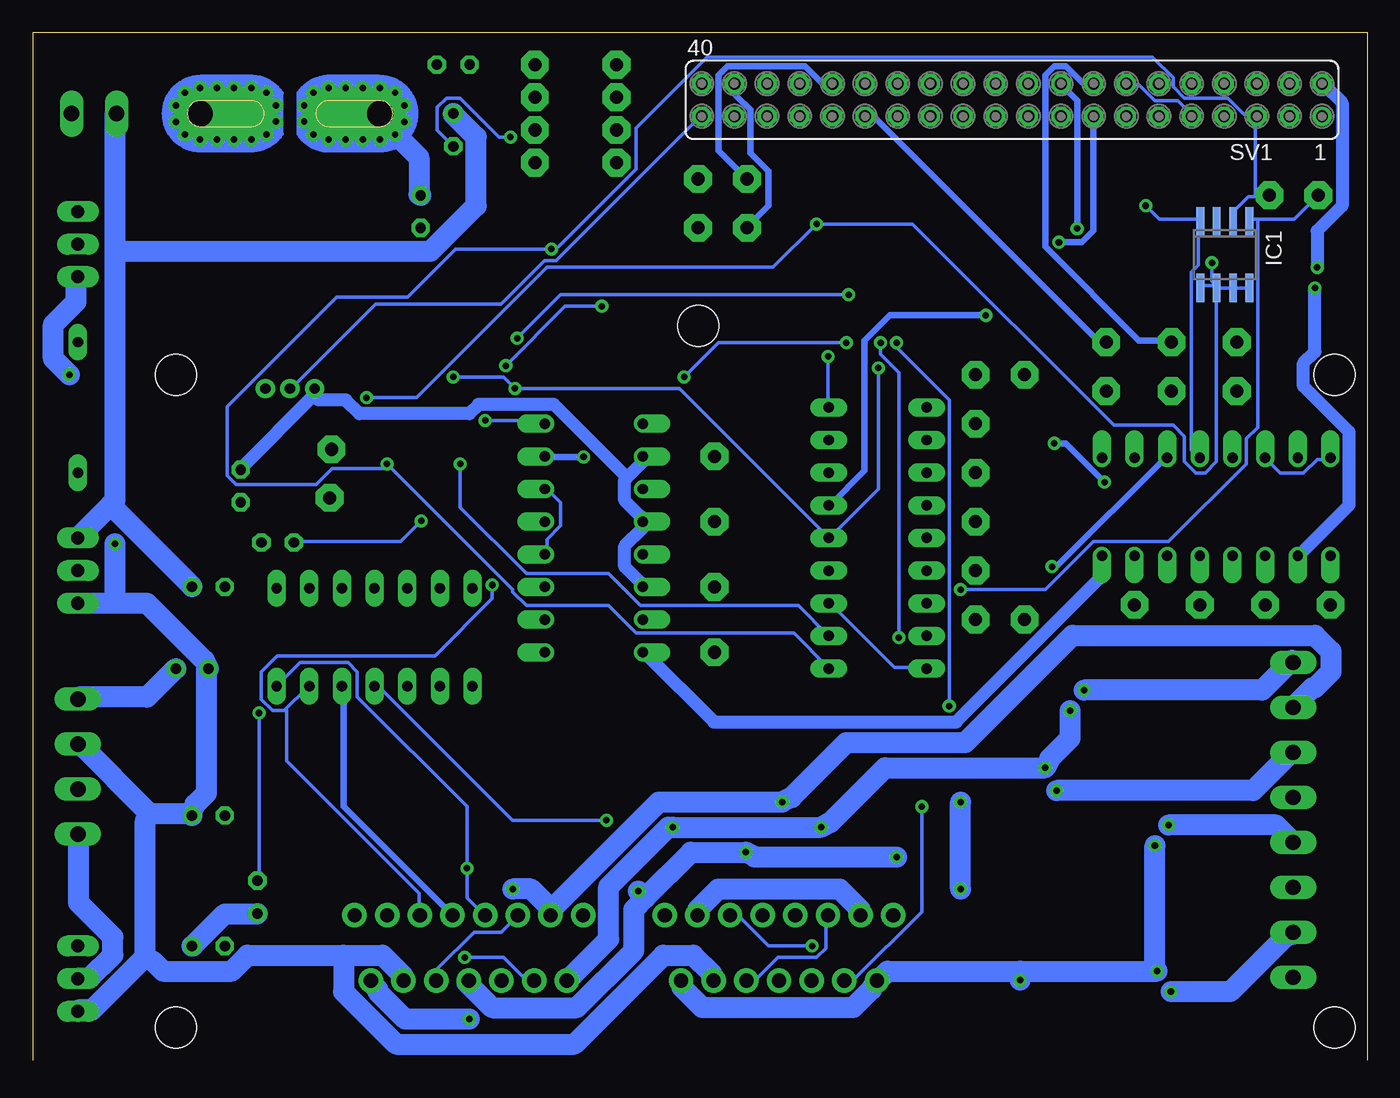
[diagram p6: board, bottom side, seen from below]

Size 103.81 x 80 mm. Coordinates in mm from the lower left corner, seen from the top.
Outline: 103.81,0 103.81,80 0,80 0,0
Copper layers (1*16): Top 0.035mm / dielectric 1.5mm / Bottom 0.035mm
Design rules "SparkFun": minimum track width 8mil, minimum drill 20mil, track to track 8mil, track to pad 8mil, pad to pad 8mil, via to via 8mil, smd to smd 8mil, copper to edge 8mil, drill to drill 8mil, minimum pad ring 12mil, minimum via ring 10mil, stop-mask expansion 4mil, vias tented up to drill 20mil, thermal gap 10mil
Holes 3.2 mm at 2.54,2.54 92.71,2.54 92.71,53.34 52.07,57.15 2.54,53.34

### Footprints (pad centres in the part's own frame; a part is rotated, then mirrored left to right if it is on the bottom)
LSP10 = drill 1.016 pad 2.159 octagon: MP 0,0
C0805 = smd 1.3 x 1.5: 1 -0.95,0; 2 0.95,0
C025-040X050 = drill 0.813 octagon: 1 -1.27,0; 2 1.27,0
DO35Z10 = drill 0.813 long: A 5.08,0; C -5.08,0
SMB = smd 2.4 x 2.4: A 2.2,0; C -2.2,0
1820 = smd 1.78 x 3.2: 1 -2.49,0; 2 2.49,0
SO8 = smd 0.6 x 2.2: 1 -1.905,-2.6; 2 -0.635,-2.6; 3 0.635,-2.6; 4 1.905,-2.6; 5 1.905,2.6; 6 0.635,2.6; 7 -0.635,2.6; 8 -1.905,2.6
SO16W = smd 0.6 x 2.2: 1 -4.445,-4.6; 2 -3.175,-4.6; 3 -1.905,-4.6; 4 -0.635,-4.6; 5 0.635,-4.6; 6 1.905,-4.6; 7 3.175,-4.6; 8 4.445,-4.6; 9 4.445,4.6; 10 3.175,4.6; 11 1.905,4.6; 12 0.635,4.6; 13 -0.635,4.6; 14 -1.905,4.6; 15 -3.175,4.6; 16 -4.445,4.6
DIL14 = drill 0.813 long: 1 -7.62,-3.81; 2 -5.08,-3.81; 3 -2.54,-3.81; 4 0,-3.81; 5 2.54,-3.81; 6 5.08,-3.81; 7 7.62,-3.81; 8 7.62,3.81; 9 5.08,3.81; 10 2.54,3.81; 11 0,3.81; 12 -2.54,3.81; 13 -5.08,3.81; 14 -7.62,3.81
DIL18 = drill 0.813 long: 1 -10.16,-3.81; 2 -7.62,-3.81; 3 -5.08,-3.81; 4 -2.54,-3.81; 5 0,-3.81; 6 2.54,-3.81; 7 5.08,-3.81; 8 7.62,-3.81; 9 10.16,-3.81; 10 10.16,3.81; 11 7.62,3.81; 12 5.08,3.81; 13 2.54,3.81; 14 0,3.81; 15 -2.54,3.81; 16 -5.08,3.81; 17 -7.62,3.81; 18 -10.16,3.81
TSSOP20 = smd 0.4 x 1.6: 1 -2.925,-2.8; 2 -2.275,-2.8; 3 -1.625,-2.8; 4 -0.975,-2.8; 5 -0.325,-2.8; 6 0.325,-2.8; 7 0.975,-2.8; 8 1.625,-2.8; 9 2.275,-2.8; 10 2.925,-2.8; 11 2.925,2.8; 12 2.275,2.8; 13 1.625,2.8; 14 0.975,2.8; 15 0.325,2.8; 16 -0.325,2.8; 17 -0.975,2.8; 18 -1.625,2.8; 19 -2.275,2.8; 20 -2.925,2.8
CB-PFF = drill 0.8 pad 1.5: 1 -1.91,-21.4; 2 0,-21.4; 3 1.91,-21.4 | drill 2 pad 4 offset: IP+ 7,0; IP- -7,0 | drill 0.5 pad 0.9: IP+@2 8.89,0.635; IP+@3 8.89,-0.635; IP+@4 8.175,-1.625; IP+@5 7,-2; IP+@6 5.675,-2; IP+@7 4.35,-2; IP+@8 3,-2; IP+@9 1.825,-1.625; IP+@10 1.1,-0.625; IP+@11 1.1,0.625; IP+@12 1.825,1.625; IP+@13 3,2; IP+@14 4.35,2; IP+@15 5.675,2; IP+@16 7,2; IP+@17 8.175,1.625; IP-@2 -8.89,0.635; IP-@3 -8.89,-0.635; IP-@4 -8.175,-1.625; IP-@5 -7,-2; IP-@6 -5.675,-2; IP-@7 -4.325,-2; IP-@8 -3,-2; IP-@9 -1.825,-1.625; IP-@10 -1.1,-0.625; IP-@11 -1.1,0.625; IP-@12 -1.825,1.625; IP-@13 -3,2; IP-@14 -4.325,2; IP-@15 -5.675,2; IP-@16 -7,2; IP-@17 -8.175,1.625
DIL16 = drill 0.813 offset: 1 -8.89,-3.81; 2 -6.35,-3.81; 3 -3.81,-3.81; 4 -1.27,-3.81; 5 1.27,-3.81; 6 3.81,-3.81; 7 6.35,-3.81; 8 8.89,-3.81; 9 8.89,3.81; 10 6.35,3.81; 11 3.81,3.81; 12 1.27,3.81; 13 -1.27,3.81; 14 -3.81,3.81; 15 -6.35,3.81; 16 -8.89,3.81
TO220BV = drill 1.016 long: D 0,-2.54; G -2.54,-2.54; S 2.54,-2.54
R0805 = smd 1.3 x 1.5: 1 -0.95,0; 2 0.95,0
R0603 = smd 1 x 1.1: 1 -0.85,0; 2 0.85,0
0204V = drill 0.813 octagon: 1 -1.27,0; 2 1.27,0
FE20-2 = drill 0.914: 1 -24.13,1.27 | drill 0.914 octagon: 2 -24.13,-1.27; 3 -21.59,1.27; 4 -21.59,-1.27; 5 -19.05,1.27; 6 -19.05,-1.27; 7 -16.51,1.27; 8 -16.51,-1.27; 9 -13.97,1.27; 10 -13.97,-1.27; 11 -11.43,1.27; 12 -11.43,-1.27; 13 -8.89,1.27; 14 -8.89,-1.27; 15 -6.35,1.27; 16 -6.35,-1.27; 17 -3.81,1.27; 18 -3.81,-1.27; 19 -1.27,1.27; 20 -1.27,-1.27; 21 1.27,1.27; 22 1.27,-1.27; 23 3.81,1.27; 24 3.81,-1.27; 25 6.35,1.27; 26 6.35,-1.27; 27 8.89,1.27; 28 8.89,-1.27; 29 11.43,1.27; 30 11.43,-1.27; 31 13.97,1.27; 32 13.97,-1.27; 33 16.51,1.27; 34 16.51,-1.27; 35 19.05,1.27; 36 19.05,-1.27; 37 21.59,1.27; 38 21.59,-1.27; 39 24.13,1.27; 40 24.13,-1.27
MULTIWATT15 = drill 1.1 pad 1.9: 1 -8.95,-2.39; 2 -7.68,2.69; 3 -6.41,-2.39; 4 -5.14,2.69; 5 -3.87,-2.39; 6 -2.6,2.69; 7 -1.33,-2.39; 8 -0.06,2.69; 9 1.21,-2.39; 10 2.48,2.69; 11 3.75,-2.39; 12 5.02,2.69; 13 6.29,-2.39; 14 7.56,2.69; 15 8.83,-2.39
317TS = drill 1.016 long: 1 -2.54,-2.54; 2 0,-2.54; 3 2.54,-2.54
SOP65P640X120-14N = smd 1.473 x 0.356: 1 -2.819,1.956; 2 -2.819,1.295; 3 -2.819,0.66; 4 -2.819,0; 5 -2.819,-0.66; 6 -2.819,-1.295; 7 -2.819,-1.956; 8 2.819,-1.956; 9 2.819,-1.295; 10 2.819,-0.66; 11 2.819,0; 12 2.819,0.66; 13 2.819,1.295; 14 2.819,1.956
8POL35 = drill 1.2 long: 1 -12.25,0; 2 -8.75,0; 3 -5.25,0; 4 -1.75,0; 5 1.75,0; 6 5.25,0; 7 8.75,0; 8 12.25,0
4POL35 = drill 1.2 long: 1 -5.25,0; 2 -1.75,0; 3 1.75,0; 4 5.25,0
2POL35 = drill 1.2 long: 1 -1.75,0; 2 1.75,0

### Placement (x,y rotation side)
ADC3  80.73,43.76 0 top
ADC4  80.6,47.54 0 top
C1  88.51,48.34 0 top
C2  90.17,36.83 0 top
C4  90.17,8.89 180 top
C5  57.15,16.51 270 top
C6  45.72,16.51 0 top
C7  81.28,16.51 90 top
C8  71.12,16.51 0 top
C9  10.6,63.99 270 top
C11  91.44,30.48 0 top
C12  90.17,19.05 180 top
C13  71.28,43.33 180 top
C14  72.12,54.67 0 top
CS_AZI  18.11,35.44 90 top
CS_ELE  13.03,35.44 90 top
D1  100.33,50.8 270 top
D2  35.31,23.21 0 top
D3  13.97,26.67 180 top
D4  47.49,22.44 0 top
D7  64.77,20.32 0 top
D8  31.62,8.86 270 top
D9  13.04,11.78 0 top
D10  27.7,15.85 0 top
D11  23.58,7.48 90 top
F2  3.95,60.88 270 top
F3  22.6,28.2 180 top
F4  24.58,21.66 180 top
F5  15.97,17.66 180 top
F6  15.82,5.97 180 top
G0  26.67,53.34 0 top
G1  30.48,53.34 0 top
G2  30.48,49.53 0 top
G3  30.48,45.72 0 top
G4  30.48,41.91 0 top
G5  30.48,38.1 0 top
G6  30.48,34.29 0 top
G7  26.67,34.29 0 top
GYA  3.81,67.31 90 top
GYL  7.62,67.31 90 top
IC1  11.09,62.7 180 bottom
IC2  38.58,62.32 180 top
IC3  77.24,32.93 180 top
IC4  38.1,40.64 90 top
IC5  62.28,64.69 90 top
IC6  83.82,73.66 0 top
L0  64.77,77.47 270 top
L1  64.77,74.93 270 top
L2  64.77,72.39 270 top
L3  64.77,69.85 270 top
L4  58.42,69.85 90 top
L5  58.42,72.39 90 top
L6  58.42,74.93 90 top
L7  58.42,77.47 90 top
OK1  60.17,40.64 90 top
OK3  11.76,43.06 180 top
P1  48.26,68.58 0 top
P2  52.07,68.58 0 top
P3  48.26,64.77 0 top
P4  52.07,64.77 0 top
PZ_CONT  50.8,41.91 0 top
PZ_INTVL  50.8,46.99 0 top
Q1  102.87,63.5 270 top
R1  95.25,48.26 0 top
R2  21.61,62.93 180 top
R3  25.4,59.69 180 top
R4  24.13,66.04 180 top
R5  29.16,68.53 270 top
R6  17.78,68.58 270 top
R7  16.51,63.5 90 top
R8  70.64,63.89 90 top
R9  72.19,59.74 180 top
R10  26.67,40.64 180 top
R11  26.67,38.1 180 top
R12  26.67,45.72 180 top
R13  26.67,49.53 180 top
R14  61.58,57.74 0 top
R15  71.12,77.47 180 top
R16  71.12,72.39 90 top
R18  86.36,12.7 270 top
R19  87.66,44.69 270 top
R20  84.79,40.29 0 top
R22  73.66,66.04 90 top
R25  58.95,27.99 0 top
R26  46.44,40.23 90 top
R27  46.25,46.41 90 top
R28  46.15,52.05 270 top
S2  50.8,36.83 0 top
S3  50.8,31.75 0 top
S4  2.87,35.44 0 top
S5  7.95,35.44 0 top
SV1  27.65,74.72 180 bottom
U1  69.85,8.89 180 top
U2  102.87,38.1 270 top
U3  102.87,6.35 270 top
U4  45.72,8.89 180 top
U$2  73.48,49.54 0 top
UAE  20.32,52.07 0 top
UAT  20.32,55.88 0 top
UBE  15.24,52.07 0 top
UBT  15.24,55.88 0 top
UCE  10.16,52.07 0 top
UCT  10.16,55.88 0 top
X1  5.77,18.7 270 top
X2  100.33,22.86 90 top
X3  99.06,73.66 180 top

### Tracks (layer width: path | path; a pad name or v marks a point on that pad's centre or on a via)
+3.3V@H
  Top 1.651: U3.2 100.28,6.4 94.06,6.4 91.57,8.89 C4.1
  Bottom 1.651: R18.2 86.41,11.38 88.9,11.38 91.39,8.89 C4.1 | X2.1 100.28,17.6 100.28,12.27 97.61,9.6 97.61,8.18 99.39,6.4 100.28,6.4 U3.2
+3.3V@L  (via drill 0.51)
  Top 0.254: v12.09,62.05 11.2,62.94 10.67,62.94 C9.2 | v42.85,65.08 42.85,66.85 IC2.1 | v86.23,27.03 86.23,38.23 84.63,39.83 84.63,45.52 78.59,51.56 v77.88,51.56
  Bottom 0.254: IC1.8 9.25,60.1 10.31,60.1 IC1.7 10.49,60.1 11.56,60.1 IC1.6 | v12.09,62.05 12.09,60.63 11.73,60.27 IC1.6 | IC1.5 12.98,60.27 11.91,60.27 IC1.6 | IC1.6 11.73,46.58 12.62,45.7 13.34,45.7 14.22,46.58 14.22,48.54 15.11,49.43 19.74,49.43 35.38,65.08 v42.85,65.08 46.23,61.7 63.83,61.7 73.97,51.56 v77.88,51.56 | v86.23,27.03 86.23,14.05 R18.1
+12V@H  (via drill 0.51)
  Top 1.651: D9.C 10.85,11.91 10.85,21.51 16,26.67 D3.C 16.89,26.31 17.96,25.25 28.09,25.25 30.05,23.29 31.65,23.29 | 31.65,23.29 33.07,23.29 D2.C | 51.03,5.69 52.63,4.09 54.23,4.09 59.03,8.89 59.03,12.09 59.21,12.27 59.21,16.36 57.96,17.6 57.25,17.6 C5.1 | 51.03,5.69 51.03,6.04 U4.4 | 51.03,5.69 50.32,5.33 49.07,4.09 37.34,4.09 36.09,5.33 36.09,6.04 31.65,10.49 31.65,11.02 D8.C 31.65,11.73 v31.65,13.34 | v31.65,20.09 31.65,23.29 | C7.1 81.25,15.47 81.25,10.85 78.59,8.18 76.63,8.18 75.03,6.58 75.03,6.22 U1.4 | v97.43,40.18 92.28,45.34 92.28,49.07 89.97,51.38 89.97,54.41 82.14,62.23 82.14,72.01 IC6.IP-@9
  Bottom 1.651: v31.65,13.34 v31.65,20.09 | R22.2 73.79,67.39 73.79,70.23 75.56,72.01 IC6.IP-@4 | 94.77,19.2 91.57,19.2 | 94.77,19.2 100.28,24.71 X2.3 | 91.57,19.2 C12.1 | 91.57,19.2 91.21,19.91 90.32,20.8 90.32,30.4 C11.1 90.5,31.11 94.94,35.56 97.43,35.56 | 95.12,8 99.21,3.91 100.28,3.91 U3.3 | 95.12,8 95.12,18.49 94.77,19.2 | 97.43,35.56 U2.3 | 97.43,35.56 v97.43,40.18 | 79.65,8.18 87.12,8.18 88.37,6.93 93.7,6.93 94.41,7.64 95.12,8 | 79.65,8.18 76.63,8.18 75.03,6.58 75.03,6.22 U1.4 | 79.65,8.18 79.65,5.33 75.56,1.25 61.7,1.25 54.76,8.18 52.45,8.18 51.03,6.76 51.03,6.22 U4.4
+12V@L
  Top 0.254: R22.1 73.08,64.19 73.08,59.92 R9.1
CAM_SERVO_AZI
  Top 0.508: OK3.15 18.14,39.12 18.14,35.56 CS_AZI.MP
CAM_SERVO_ELE
  Top 0.508: OK3.13 13.16,39.12 13.16,35.56 CS_ELE.MP
GND@H  (via drill 0.51)
  Top 1.651: C2.2 91.57,36.8 91.57,31.65 92.63,30.58 C11.2 92.46,29.69 92.46,22.94 89.26,19.74 88.9,19.02 | R16.2 71.12,76.1 69.88,77.34 R15.2 | R1.1 94.41,48.18 94.41,46.58 100.28,40.72 U2.1 | 57.07,13.16 57.07,10.85 54.41,8.18 47.47,8.18 45.87,6.58 45.87,6.22 U4.8 | 57.07,13.16 57.07,15.47 C5.2 | D11.A 23.65,9.78 29.87,16 D10.A 30.58,15.82 v36.63,15.82 | 46.76,16.54 46.76,18.67 49.61,21.51 49.61,22.4 D4.A | 46.76,16.54 C6.2 | 72.01,17.42 72.01,17.6 69.34,20.27 67.03,20.27 D7.A | 72.01,17.42 72.01,16.54 C8.2 | 87.48,17.6 81.43,17.6 C7.2 80.54,17.42 72.01,17.42 | 88.9,19.02 87.48,17.6 | 88.9,19.02 C12.2 | 88.9,10.85 88.9,15.82 87.83,16.89 87.48,17.6 | 88.9,10.85 C4.2 88.19,8.53 83.74,4.09 71.65,4.09 70.05,5.69 70.05,6.04 U1.8 | U3.1 94.23,8.89 92.28,10.85 88.9,10.85 | v48.36,16.18 47.47,16.18 46.76,16.54 | v56.72,13.16 57.07,13.16
  Bottom 1.651: X2.4 100.28,28.27 94.94,28.27 92.81,30.4 C11.2 | 97.43,62.94 97.43,43.56 97.79,43.2 | 97.43,62.94 97.43,73.61 X3.2 | 97.79,43.2 100.28,40.72 U2.1 | 97.43,62.94 72.9,62.94 69.34,66.5 69.34,71.83 71.12,73.61 R16.2 | 97.79,43.2 91.57,36.98 C2.2 | 56.19,12.62 57.07,11.73 57.07,8.53 61.52,4.09 68.1,4.09 70.05,6.04 U1.8 | 56.19,12.62 52.63,16.18 v48.36,16.18 47.65,15.82 v36.63,15.82 | v56.72,13.16 56.19,12.62
GND@L  (via drill 0.51)
  Top 0.254: 75.3,50.41 75.21,50.49 75.21,51.21 75.39,51.38 76.28,51.38 U$2.14 | 75.3,50.41 75.39,50.32 76.28,50.32 U$2.12 | U$2.5 70.76,48.9 70.76,49.43 U$2.4 | 69.61,49.87 69.88,49.61 70.59,49.61 U$2.4 | 69.61,49.87 69.52,49.96 69.52,50.49 69.88,50.85 70.59,50.85 U$2.2 70.76,50.85 71.48,50.85 72.9,52.27 72.9,54.59 C14.2 72.9,54.76 72.9,58.32 72.19,59.03 72.19,63.3 70.76,64.72 R8.2 70.76,64.9 70.76,70.76 R16.1 70.94,71.12 69.88,72.19 69.88,74.5 65.43,78.94 64.19,78.94 62.76,77.52 62.76,66.67 60.45,64.36 59.56,64.36 IC5.16 59.38,64.36 58.5,64.36 58.32,64.54 58.32,66.14 58.5,66.32 59.38,66.32 IC5.13 | 75.3,50.41 75.21,50.32 73.61,50.32 72.9,49.61 70.76,49.61 U$2.4 | v66.67,71.83 66.85,71.65 66.85,67.21 65.96,66.32 65.25,66.32 IC5.8 | OK3.2 17.96,46.76 17.07,46.76 16,45.7 14.22,45.7 13.16,46.76 OK3.4 12.98,46.76 11.91,46.76 10.85,45.7 9.07,45.7 8,46.76 OK3.6 8,46.94 8,62.41 10.49,64.9 C9.1 | C13.2 70.23,43.2 70.23,37.34 69.7,36.8 IC3.7 69.52,36.63 68.36,35.47 | 68.36,35.47 67.21,34.31 64.01,34.31 OK1.2 | 68.36,35.47 64.54,39.29 64.01,39.29 OK1.4 | 60.81,55.12 60.81,52.63 63.83,49.61 OK1.8 63.83,49.43 62.76,48.36 62.76,46.58 63.83,45.52 63.83,44.45 OK1.6 | 60.81,55.12 60.81,57.61 R14.1 | 41.78,62.41 41.78,66.85 IC2.2 | 41.78,62.41 41.78,59.21 | 41.78,59.21 41.78,57.78 IC2.15 | 43.65,56.45 43.74,56.54 43.74,59.03 43.56,59.21 41.78,59.21 | 43.65,56.45 v41.96,54.76 | 20.98,64.36 22.58,65.96 23.11,65.96 R4.2 23.29,65.96 24.18,65.08 34.14,65.08 | 20.98,64.36 20.8,64.19 20.8,62.94 R2.2 | 20.98,64.36 18.05,67.3 | 18.05,67.3 17.78,67.56 R6.2 | 34.14,65.08 34.14,66.85 IC2.8
  Top 0.254: 34.14,65.08 34.14,62.41 | 34.14,62.41 34.14,57.78 IC2.9 | 34.14,62.41 41.78,62.41 | 60.81,55.12 44.98,55.12 43.65,56.45 | 18.05,67.3 v17.25,66.5 | v68.63,49.78 69.52,49.78 69.61,49.87
  Bottom 0.254: v66.67,71.83 67.56,71.83 70.59,74.85 71.65,74.85 72.36,74.14 72.36,72.36 R16.1 | OK3.4 13.16,46.94 13.69,47.47 13.69,61.34 13.16,61.87 13.16,65.25 IC1.4 13.16,65.43 16.18,65.43 v17.25,66.5 | OK3.8 3.02,46.76 3.91,46.76 4.98,45.7 6.76,45.7 7.82,46.76 OK3.6 | OK1.4 63.83,39.47 63.83,40.54 62.76,41.6 62.76,43.38 63.83,44.45 OK1.6 | v41.96,54.76 41.96,50.85 IC4.9 | v68.63,49.78 64.19,49.78 64.01,49.61 OK1.8
GND@M
  Top 0.254: 85.08,53.43 83.92,52.27 IC6.2 | 85.08,53.43 85.17,53.52 86.06,53.52 89.43,50.14 89.43,48.36 C1.2 | R15.1 72.54,77.34 72.54,70.05 84.99,57.61 84.99,53.52 85.08,53.43 | SV1.9 13.51,73.61 12.62,73.61 11.38,74.85 9.78,74.85 8.71,75.92 SV1.6 | SV1.14 18.85,76.1 19.91,77.17 24.36,77.17 25.43,76.1 26.31,76.1 SV1.20 26.49,75.92 27.38,75.92 28.63,74.68 32.89,74.68 33.96,73.61 SV1.25 34.14,73.61 35.03,73.61 36.27,74.85 37.87,74.85 38.94,75.92 SV1.30 39.12,76.1 40.18,77.17 42.14,77.17 43.2,76.1 44.09,76.1 SV1.34 44.27,76.1 45.34,77.17 47.12,77.17 47.83,76.45 47.83,75.74 48.72,74.85 49.43,74.85 50.67,73.61 51.74,73.61 SV1.39
  Bottom 0.254: SV1.14 18.67,75.92 17.78,75.92 16.54,74.68 14.76,74.68 13.69,73.61 SV1.9 | IC6.2 83.74,52.27 77.17,58.85 67.39,58.85 64.01,62.23 63.12,62.23 51.92,73.43 SV1.39
GP0
  Top 0.508: 34.85,51.38 34.31,50.85 IC4.10 | 34.85,51.38 36.27,52.81 46.05,52.81 R28.1 | G0.MP 28.27,53.34 29.87,54.94 31.29,54.94 34.85,51.38
GP1
  Top 0.508: R27.1 46.23,45.7 44.45,45.7 43.2,46.94 35.56,46.94 34.31,48.18 IC4.11 34.14,48.36 30.58,51.92 30.58,53.34 G1.MP
GP2
  Top 0.508: R26.1 46.41,39.47 45.52,39.47 43.03,41.96 38.05,41.96 IC4.12 G2.MP
GP3
  Top 0.508: R25.1 57.96,28.09 49.25,28.09 43.03,34.31 40.72,34.31 36.27,38.76 36.27,41.07 34.31,43.03 IC4.13 34.14,43.38 31.83,45.7 30.58,45.7 G3.MP
GP4
  Top 0.508: R13.1 27.56,49.43 27.56,47.47 28.8,46.23 28.8,43.56 30.4,41.96 G4.MP 30.58,41.78 31.65,40.72 34.14,40.72 IC4.14
GP5
  Top 0.508: R12.1 27.56,45.7 27.56,42.32 30.4,39.47 30.4,38.23 G5.MP 30.58,38.23 34.14,38.23 IC4.15
GP6
  Top 0.508: R11.1 27.56,38.05 27.56,37.16 30.4,34.31 G6.MP 30.58,34.49 31.65,35.56 IC4.16
GP7
  Top 0.508: R10.1 27.38,40.54 26.85,40.01 26.85,39.83 26.49,39.47 24.18,39.47 23.47,38.76 23.47,37.52 26.67,34.31 G7.MP 26.85,34.14 28.27,32.72 31.11,32.72 31.29,32.89 34.14,32.89 IC4.17
GPIO3  (via drill 0.51)
  Top 0.508: v24,63.65 v29.69,57.96
  Bottom 0.508: v29.69,57.96 37.16,57.96 39.12,56.01 39.12,45.87 41.78,43.2 IC4.6 | v24,63.65 22.23,63.65 21.34,64.54 21.34,73.43 SV1.15
GPIO6
  Top 0.254: IC5.17 59.38,63.83 58.32,63.83 55.12,67.03 55.12,74.32 51.74,77.7 30.58,77.7 28.98,76.1 SV1.22
ML_B
  Top 0.508: U1.10 67.39,6.22 67.39,7.47 71.12,11.2 U1.7
  Bottom 0.508: IC3.12 79.65,28.98 79.65,19.74 71.3,11.38 U1.7
ML_DIR  (via drill 0.51)
  Top 0.254: v70.23,8 73.61,11.38 U1.5 | v40.54,55.83 40.54,57.61 IC2.14 | v53.16,53.16 56.01,53.16 62.23,46.94 62.23,44.63 63.83,43.03 65.79,43.03 68.1,40.72 v68.1,36.98
  Bottom 0.254: v70.23,8 67.21,8 65.43,6.22 64.9,6.22 U1.12 | v40.54,55.83 50.49,55.83 v53.16,53.16 | v68.1,36.98 68.1,35.92 72.54,31.47 84.81,31.47 86.06,30.23 86.06,28.09 85.17,27.2 84.28,27.2 84.19,27.29 | 84.19,27.29 82.5,28.98 IC3.13 | U1.5 73.79,11.38 73.79,12.98 84.1,23.29 84.1,27.2 84.19,27.29
ML_DIR_
  Top 0.508: IC2.3 40.54,67.03 40.54,67.92 41.25,68.63 45.87,68.63 47.47,67.03 52.81,67.03 53.7,67.92 53.7,69.16 49.25,73.61 SV1.37
ML_OUT_A  (via drill 0.51)
  Top 1.651: v42.49,18.14 37.52,23.11 D2.A | v54.05,18.14 56.19,20.27 62.41,20.27 D7.C | v25.07,22.76 26.14,21.69 27.03,21.69 F4.1 | v23.11,27.2 24,28.09 25.07,28.09 F3.1 | v69.88,3.2 64.9,3.2 62.41,5.69 62.41,6.04 U1.14
  Bottom 1.651: U1.14 62.23,6.22 59.03,9.42 59.03,13.51 54.41,18.14 v54.05,18.14 v42.49,18.14 41.78,18.49 37.52,22.76 v25.07,22.76 24.71,23.47 23.11,25.07 v23.11,27.2 | v69.88,3.2 74.85,3.2 76.99,5.33 76.99,5.51 77.52,6.04 U1.2
ML_OUT_B  (via drill 0.51)
  Top 1.651: 8.71,26.67 6.58,26.67 5.87,27.38 X1.2 | 8.71,26.67 D3.A | 8.71,26.67 8.71,23.11 6.22,20.62 5.87,20.62 X1.4 | v45.52,20.09 45.34,20.27 45.34,22.4 D4.C | v66.5,13.34 74.5,13.34 76.1,11.73 76.1,11.38 U1.3
  Bottom 1.651: 63.48,11.73 55.12,20.09 v45.52,20.09 44.81,20.45 40.54,24.71 31.29,24.71 22.94,33.07 4.09,33.07 2.85,31.83 2.85,30.23 4.09,28.98 4.27,28.98 5.69,27.56 X1.2 | 63.48,11.73 63.48,11.38 U1.13 | v66.5,13.34 65.08,13.34 63.48,11.73
ML_SPEED  (via drill 0.51)
  Top 0.254: v40.36,59.56 39.29,58.5 39.29,57.78 IC2.13 | v66.14,56.19 66.14,53.7 67.21,52.63 67.21,48.54 70.23,45.52 72.01,45.52 75.92,41.6 75.92,28.09 69.7,21.87 65.61,21.87 65.25,21.51 65.25,12.09 65.96,11.38 U1.11
  Bottom 0.254: v40.36,59.56 62.76,59.56 v66.14,56.19 | U1.6 72.36,6.22 72.36,7.11 69.52,9.96 67.39,9.96 66.14,11.2 U1.11
ML_SPEED_
  Top 0.508: IC2.4 39.29,67.03 39.29,67.92 43.56,72.19 45.34,72.19 46.58,73.43 SV1.35
MR_B
  Top 0.508: IC3.10 74.68,28.98 68.28,22.58 56.54,22.58 49.61,15.65 49.61,13.87 47.12,11.38 U4.7 46.94,11.2 43.38,7.64 43.38,6.22 U4.10
MR_DIR  (via drill 0.51)
  Top 0.254: v59.21,18.67 58.5,18.67 58.32,18.85 56.54,18.85 49.61,11.91 49.61,11.38 U4.5 | v37.87,55.83 37.87,57.61 IC2.12 | v36.45,32.89 35.2,31.65 33.25,31.65 31.65,30.05 31.65,27.2 33.96,24.89 34.31,24.89 34.67,24.54 v34.67,19.74 | v43.2,8.89 40.54,6.22 U4.12
  Bottom 0.254: v59.21,18.67 66.5,18.67 76.81,28.98 77.17,28.98 IC3.11 | v37.87,55.83 37.87,54.94 36.45,53.52 v36.45,32.89 | v34.67,19.74 34.67,11.56 40.01,6.22 40.54,6.22 U4.12 | v43.2,8.89 46.58,8.89 48.9,11.2 49.43,11.2 U4.5
MR_DIR_
  Top 0.508: IC2.5 38.05,67.03 38.05,67.92 43.56,73.43 44.09,73.43 SV1.33
MR_OUT_A  (via drill 0.51)
  Top 1.651: 27.03,5.33 30.23,5.33 31.47,6.58 D8.A | 27.03,5.33 23.65,5.33 D11.C | v16.36,6.93 17.25,6.04 18.14,6.04 F6.1 | v16.54,16.71 17.42,17.6 18.31,17.6 F5.1 | v27.03,6.22 27.03,5.33
  Bottom 1.651: 27.03,6.93 37.34,6.93 38.05,6.22 U4.14 38.58,5.51 40.01,4.09 51.74,4.09 53.34,5.69 53.34,6.04 U4.2 | 27.03,6.93 16.54,6.93 | 16.54,6.93 v16.36,6.93 | 16.54,6.93 v16.54,16.71 | v27.03,6.22 27.03,6.93
MR_OUT_B
  Top 1.651: X1.6 5.69,13.51 2.85,10.67 2.85,9.07 5.33,6.58 5.69,6.58 X1.8 6.58,6.58 9.25,6.58 12.09,9.42 12.62,9.42 14.58,11.38 D9.A 15.29,11.91 21.51,11.91 25.43,15.82 D10.C 26.14,16.36 27.91,18.14 36.98,18.14 39.29,15.82 39.29,11.38 U4.13
  Bottom 1.651: U4.13 39.47,11.38 39.47,11.73 41.07,13.34 50.49,13.34 52.09,11.73 52.09,11.38 U4.3
MR_SPEED  (via drill 0.51)
  Top 0.254: v36.63,55.83 36.63,57.61 IC2.11 | v32.54,27.56 35.92,24.18 35.92,20.98 41.96,14.94 41.96,11.38 U4.11
  Bottom 0.254: v36.63,55.83 36.63,55.47 32.54,51.38 v32.54,27.56 | U4.6 48.18,6.22 47.65,6.22 45.87,8 42.85,8 42.14,8.71 42.14,11.2 U4.11
MR_SPEED_
  Top 0.508: IC2.6 36.8,67.03 36.8,68.63 41.6,73.43 SV1.31
N$1
  Top 0.254: R14.2 62.59,57.78 62.59,59.21 65.08,61.7 IC5.1
N$2
  Top 0.508: 97.97,48.18 96.37,48.18 R1.2 | 97.97,48.18 100.28,45.87 D1.A | 97.97,48.18 102.41,52.63 102.41,64.19 101.7,64.9 101.52,64.9 100.46,65.96 Q1.G
N$4
  Top 1.651: 99.39,63.48 97.61,61.7 97.61,60.1 100.28,57.43 100.28,56.01 D1.C | 99.39,63.48 100.28,63.48 Q1.D | 99.39,63.48 97.61,65.25 97.61,66.85 100.64,69.88 100.64,73.61 X3.1
N$5  (via drill 0.51)
  Top 1.016: SV1.2 3.56,76.1 6.04,76.1 SV1.4 | v3.91,61.7 3.91,63.3 F2.1
  Bottom 1.016: v3.91,61.7 3.91,64.54 1.96,66.5 1.96,74.5 3.38,75.92 SV1.2
N$6
  Top 0.254: IC5.11 59.38,67.74 59.38,68.81 58.5,69.7 L4.MP
N$7  (via drill 0.51)
  Top 1.651: v22.05,28.8 21.51,28.27 20.27,28.27 F3.2
  Bottom 1.651: v22.05,28.8 8.18,28.8 5.87,31.11 X1.1
N$8
  Top 0.254: IC5.10 65.08,67.74 65.08,69.52 64.9,69.7 L3.MP
N$12
  Top 0.254: IC5.9 65.25,67.03 65.96,67.03 66.32,67.39 66.32,70.94 64.9,72.36 L2.MP
N$13
  Top 0.508: R10.2 25.78,40.72 25.78,41.78 20.8,46.76 OK3.1
N$20
  Top 0.254: U$2.11 76.45,49.43 77.17,49.43 79.12,47.47 79.12,45.52 80.72,43.92 ADC3.MP
N$21  (via drill 0.51)
  Top 0.508: v24.54,38.41 24.71,38.23 25.78,38.23 R11.2
  Bottom 0.508: v24.54,38.41 24.18,38.41 15.65,46.94 OK3.3
N$22
  Top 0.508: R7.1 16.54,62.59 16.54,56.9 20.27,53.16 20.27,52.09 UAE.MP
N$23
  Top 0.508: R12.2 25.78,45.87 24.89,45.87 21.16,49.61 12.62,49.61 10.67,47.65 10.67,46.94 OK3.5
N$24
  Top 0.508: R3.1 26.14,59.56 26.14,55.65 20.98,50.49 16.71,50.49 15.29,51.92 UBE.MP
N$25  (via drill 0.51)
  Top 0.508: v24.36,48.01 25.78,49.43 R13.2 | v20.45,44.98 7.29,44.98 5.51,46.76 OK3.7
  Bottom 0.508: v24.36,48.01 23.47,48.01 v20.45,44.98
N$26  (via drill 0.51)
  Top 1.651: v24.18,20.98 23.65,21.51 22.23,21.51 F4.2
  Bottom 1.651: v24.18,20.98 8.89,20.98 5.87,24 X1.3
N$27
  Top 0.254: IC5.7 65.08,65.79 64.01,65.79 63.3,66.5 63.3,73.43 64.72,74.85 L1.MP
N$28
  Top 0.254: L0.MP 67.56,74.68 67.56,66.67 65.96,65.08 65.25,65.08 IC5.6
N$29
  Top 0.254: IC5.15 59.56,65.08 60.45,65.08 61.7,66.32 61.7,74.14 58.5,77.34 L7.MP
N$31
  Top 0.254: L6.MP 61.16,72.19 61.16,66.5 60.45,65.79 59.56,65.79 IC5.14
N$33
  Top 0.508: R5.1 29.16,69.52 25.96,69.52 22.58,72.9 22.58,73.97 21.87,74.68 15.65,74.68 14.94,73.97 14.94,57.78 10.31,53.16 10.31,52.09 UCE.MP
N$34  (via drill 0.51)
  Top 1.651: v15.47,18.31 14.94,17.78 13.51,17.78 F5.2
  Bottom 1.651: v15.47,18.31 7.11,18.31 5.87,17.07 X1.5
N$36  (via drill 0.51)
  Top 1.651: v15.29,5.33 14.76,5.87 13.34,5.87 F6.2
  Bottom 1.651: v15.29,5.33 10.67,5.33 6.22,9.78 5.87,9.78 X1.7
N$43
  Top 0.254: IC5.12 59.56,67.03 60.45,67.03 60.63,67.21 60.63,70.23 58.5,72.36 L5.MP
N$44
  Top 0.508: R25.2 59.92,28.09 60.27,28.09 63.83,31.65 OK1.1
N$45
  Top 0.508: R26.2 46.58,41.07 49.43,41.07 50.14,40.36 54.23,40.36 54.41,40.54 60.27,40.54 63.83,36.98 OK1.3
N$46
  Top 0.508: R27.2 46.41,47.12 48.36,47.12 50.14,45.34 54.05,45.34 54.41,45.7 60.1,45.7 63.83,41.96 OK1.5
N$47  (via drill 0.51)
  Top 0.508: v60.98,46.94 56.9,51.03 46.23,51.03 R28.2
  Bottom 0.508: v60.98,46.94 63.83,46.94 OK1.7
N$48  (via drill 0.51)
  Top 1.651: v100.99,53.34 99.57,53.34 92.1,60.81 92.1,72.01 IC6.IP+@4
  Bottom 1.651: v100.99,53.34 102.23,54.59 102.23,57.25 100.46,59.03 100.46,60.81 Q1.S
N$49
  Top 0.254: U$2.13 76.45,50.85 77.34,50.85 80.54,47.65 ADC4.MP
PIEZO_CONT
  Top 0.508: OK1.11 53.34,44.45 PZ_CONT.MP
PIEZO_INTVL
  Top 0.508: OK1.9 56.19,49.43 53.16,49.43 50.85,47.12 PZ_INTVL.MP
PIR1
  Bottom 0.508: SV1.32 41.78,76.1 42.49,76.1 43.74,77.34 49.78,77.34 50.49,76.63 50.49,70.76 48.36,68.63 P1.MP
PIR2
  Top 0.508: SV1.36 46.76,75.92 46.76,75.21 48.01,73.97 48.01,72.54 51.92,68.63 P2.MP
PIR3
  Bottom 0.508: SV1.38 49.07,75.92 49.07,75.03 48.01,73.97 48.01,70.59 46.58,69.16 46.58,66.5 48.18,64.9 P3.MP
PIR4
  Top 0.508: SV1.40 51.92,75.92 51.92,75.21 54.41,72.72 54.41,67.21 52.09,64.9 P4.MP
SCL1  (via drill 0.51)
  Top 0.254: v76.28,46.41 76.28,47.47 U$2.8 | v63.48,63.12 59.56,63.12 IC5.18
  Bottom 0.254: 8.71,67.21 7.64,67.21 GYL.MP | 8.71,67.21 9.25,67.21 10.31,66.14 10.31,65.43 IC1.2 | 8.71,67.21 8.71,73.43 SV1.5 8.71,73.61 9.6,73.61 10.85,74.85 14.22,74.85 15.11,75.74 15.11,76.45 16.71,78.05 51.38,78.05 56.9,72.54 56.9,69.34 63.12,63.12 v63.48,63.12 70.94,63.12 74.68,59.38 80.19,59.38 88.72,50.85 88.72,45.52 88.01,44.81 81.79,44.81 80.54,46.05 76.1,46.05 v76.28,46.41 66.5,36.63 66.5,36.45 65.43,35.38 59.03,35.38 56.9,33.25 44.63,33.25 41.96,30.58 IC4.1
SDA1  (via drill 0.51)
  Top 0.254: SV1.3 6.04,73.43 6.04,69.52 3.91,67.39 GYA.MP | v70.59,46.41 70.59,47.47 U$2.7 70.59,47.65 69.52,47.65 67.74,49.43 67.74,52.81 67.03,53.52 v67.03,54.05 | v59.56,58.67 58.32,59.92 58.32,62.23 58.5,62.41 59.38,62.41 IC5.19 | v31.65,36.63 37.52,36.63 41.07,33.07 41.78,33.07 IC4.2
  Bottom 0.254: 8.53,65.43 5.69,65.43 GYA.MP | 8.53,65.43 9.07,65.43 IC1.1 | v70.59,46.41 70.59,43.03 65.43,37.87 59.03,37.87 56.54,35.38 44.27,35.38 IC4.2 | v59.56,58.67 62.41,58.67 v67.03,54.05 | 8.53,65.43 8.53,49.25 9.42,48.36 9.42,46.41 15.47,40.36 21.34,40.36 25.07,36.63 v31.65,36.63
SPLY_AMP_SENS
  Top 0.254: U$2.3 70.76,50.32 72.9,50.32 75.03,52.45 80.19,52.45 81.61,51.03 84.63,51.03 85.7,52.09 IC6.3
SPLY_VLTG_SENS
  Top 0.254: R8.1 70.76,62.94 70.76,60.45 71.3,59.92 R9.2 71.3,59.74 70.05,58.5 70.05,52.98 70.59,52.45 70.59,51.56 U$2.1
SW2
  Top 0.508: OK1.13 56.19,39.29 53.16,39.29 50.85,36.98 S2.MP
SW3
  Top 0.508: OK1.15 56.19,34.14 53.16,34.14 50.85,31.83 S3.MP
SW4
  Top 0.254: OK3.9 3.02,39.12 3.02,35.56 S4.MP
SW5
  Top 0.508: OK3.11 8,39.12 8,35.56 S5.MP
USM_A_ECHO
  Top 0.508: R7.2 16.36,64.36 16.36,65.96 16.18,66.14 16.18,67.92 17.78,69.52 R6.1 17.6,69.7 16.36,70.94 16.36,73.43 SV1.11
USM_A_TRIG
  Bottom 0.508: SV1.29 38.94,73.43 38.41,73.43 20.98,56.01 20.45,56.01 UAT.MP
USM_B_ECHO  (via drill 0.51)
  Top 0.508: R3.2 24.54,59.74 22.58,61.7 22.58,62.76 R2.1 22.58,63.12 v22.58,64.72
  Bottom 0.508: v22.58,64.72 22.58,74.68 23.82,75.92 SV1.18
USM_B_TRIG
  Bottom 0.508: SV1.16 21.34,76.1 22.23,76.1 23.47,77.34 24.36,77.34 25.07,76.63 25.07,63.3 17.78,56.01 15.29,56.01 UBT.MP
USM_C_ECHO
  Top 0.508: R5.2 29.16,67.56 27.74,66.14 25.07,66.14 R4.1 24.89,66.32 24.89,67.39 18.85,73.43 SV1.13
USM_C_TRIG
  Top 0.508: SV1.7 11.2,73.43 11.2,66.5 13.16,64.54 13.16,58.85 10.31,56.01 UCT.MP
VCC@H
  Top 1.651: 86.23,40.36 86.23,41.96 87.66,43.38 R19.2 | 86.23,40.36 R20.2 | 88.9,37.34 C2.1 | 88.9,37.34 86.59,39.65 86.23,40.36 | 97.43,38.23 92.81,38.23 92.28,38.76 90.68,38.76 89.61,37.69 88.9,37.34 | 97.43,38.23 100.28,38.23 U2.2 | 97.43,38.23 97.43,23.82 98.68,22.58 98.86,22.58 100.28,21.16 X2.2
VCC@L  (via drill 0.51)
  Top 0.254: v70.05,14.94 70.05,16.36 C8.1 | U$2.6 70.76,48.36 76.28,48.36 U$2.9 | U$2.10 76.45,48.72 76.45,48.36 U$2.9 | IC3.14 84.81,29.16 84.81,34.49 83.57,35.74 83.57,40.18 R20.1 83.39,40.36 81.97,40.36 78.59,43.74 78.59,46.76 77.17,48.18 76.45,48.18 U$2.9 | IC5.5 65.08,63.83 IC5.4 65.08,63.65 65.08,63.12 IC5.3 65.08,62.94 65.08,62.59 IC5.2 | 66.5,52.27 66.5,52.63 65.25,53.87 65.25,60.45 66.32,61.52 66.32,62.05 65.96,62.41 65.25,62.41 IC5.2 | 66.5,52.27 66.5,48.54 70.05,44.98 70.59,44.98 72.19,43.38 C13.1 72.36,43.2 v73.61,41.96 | v71.12,53.16 71.12,54.59 C14.1 | 66.5,52.27 v66.32,52.27 | IC5.20 59.56,61.87 63.65,61.87 64.19,62.41 65.08,62.41 IC5.2 | 38.05,54.94 40.89,54.94 42.85,56.9 42.85,57.61 IC2.16 | 38.05,54.94 36.27,54.94 35.56,55.65 35.56,57.61 IC2.10 | U4.9 44.63,11.38 44.63,16.36 C6.1 44.63,16.54 44.63,19.2 34.31,29.52 34.31,30.4 IC4.18 | IC4.5 41.96,40.54 41.96,38.23 IC4.4 41.96,38.05 41.96,35.56 IC4.3 | v38.05,53.87 38.05,54.94
  Bottom 0.254: U1.9 68.81,11.38 70.05,12.62 v70.05,14.94 70.05,19.74 78.59,28.27 78.59,30.23 79.3,30.94 83.03,30.94 84.81,29.16 IC3.14 | v71.12,53.16 67.21,53.16 v66.32,52.27 53.52,52.27 41.96,40.72 IC4.5 41.78,40.72 38.05,44.45 v38.05,53.87 | IC4.18 34.31,30.58 36.8,30.58 41.78,35.56 IC4.3 | v73.61,41.96 75.21,40.36 83.39,40.36 R20.1
VCC@M  (via drill 0.51)
  Top 1.016: OK3.10 5.51,39.29 5.87,39.29 7.29,40.72 9.07,40.72 10.49,39.29 OK3.12 10.85,39.65 11.91,40.72 13.69,40.72 15.11,39.29 15.47,39.29 OK3.14 16,39.47 17.25,40.72 18.67,40.72 20.09,39.29 20.62,39.29 OK3.16 | v4.09,60.1 4.09,58.5 F2.2 | C1.1 87.66,48.18 87.66,46.05 R19.1 | OK1.16 56.36,31.83 56.36,32.18 57.78,33.6 57.78,35.38 56.36,36.8 OK1.14
  Bottom 1.016: v4.09,60.1 4.09,55.12 4.98,54.23 4.98,52.45 1.42,48.9 1.42,43.2 5.33,39.29 OK3.10 | 81.97,51.74 81.97,52.09 IC6.1 | 81.97,51.74 87.66,46.05 R19.1 | OK1.14 56.36,36.98 57.78,38.41 57.78,40.01 56.36,41.43 56.36,41.78 OK1.12 56.54,42.32 57.78,43.56 57.78,45.16 57.61,45.34 | 57.61,45.34 56.36,46.58 56.36,46.94 OK1.10 | 57.61,45.34 63.3,51.03 69.16,51.03 69.88,50.32 78.41,50.32 79.48,51.38 81.61,51.38 81.97,51.74 | OK3.16 20.8,39.12 20.8,37.52 32,26.31 50.85,26.31 56.19,31.65 OK1.16

### Text on the board
Top: AlMaBot v1.0